# EAGLE design RobotControlBoard (EAGLE 6.5.0)
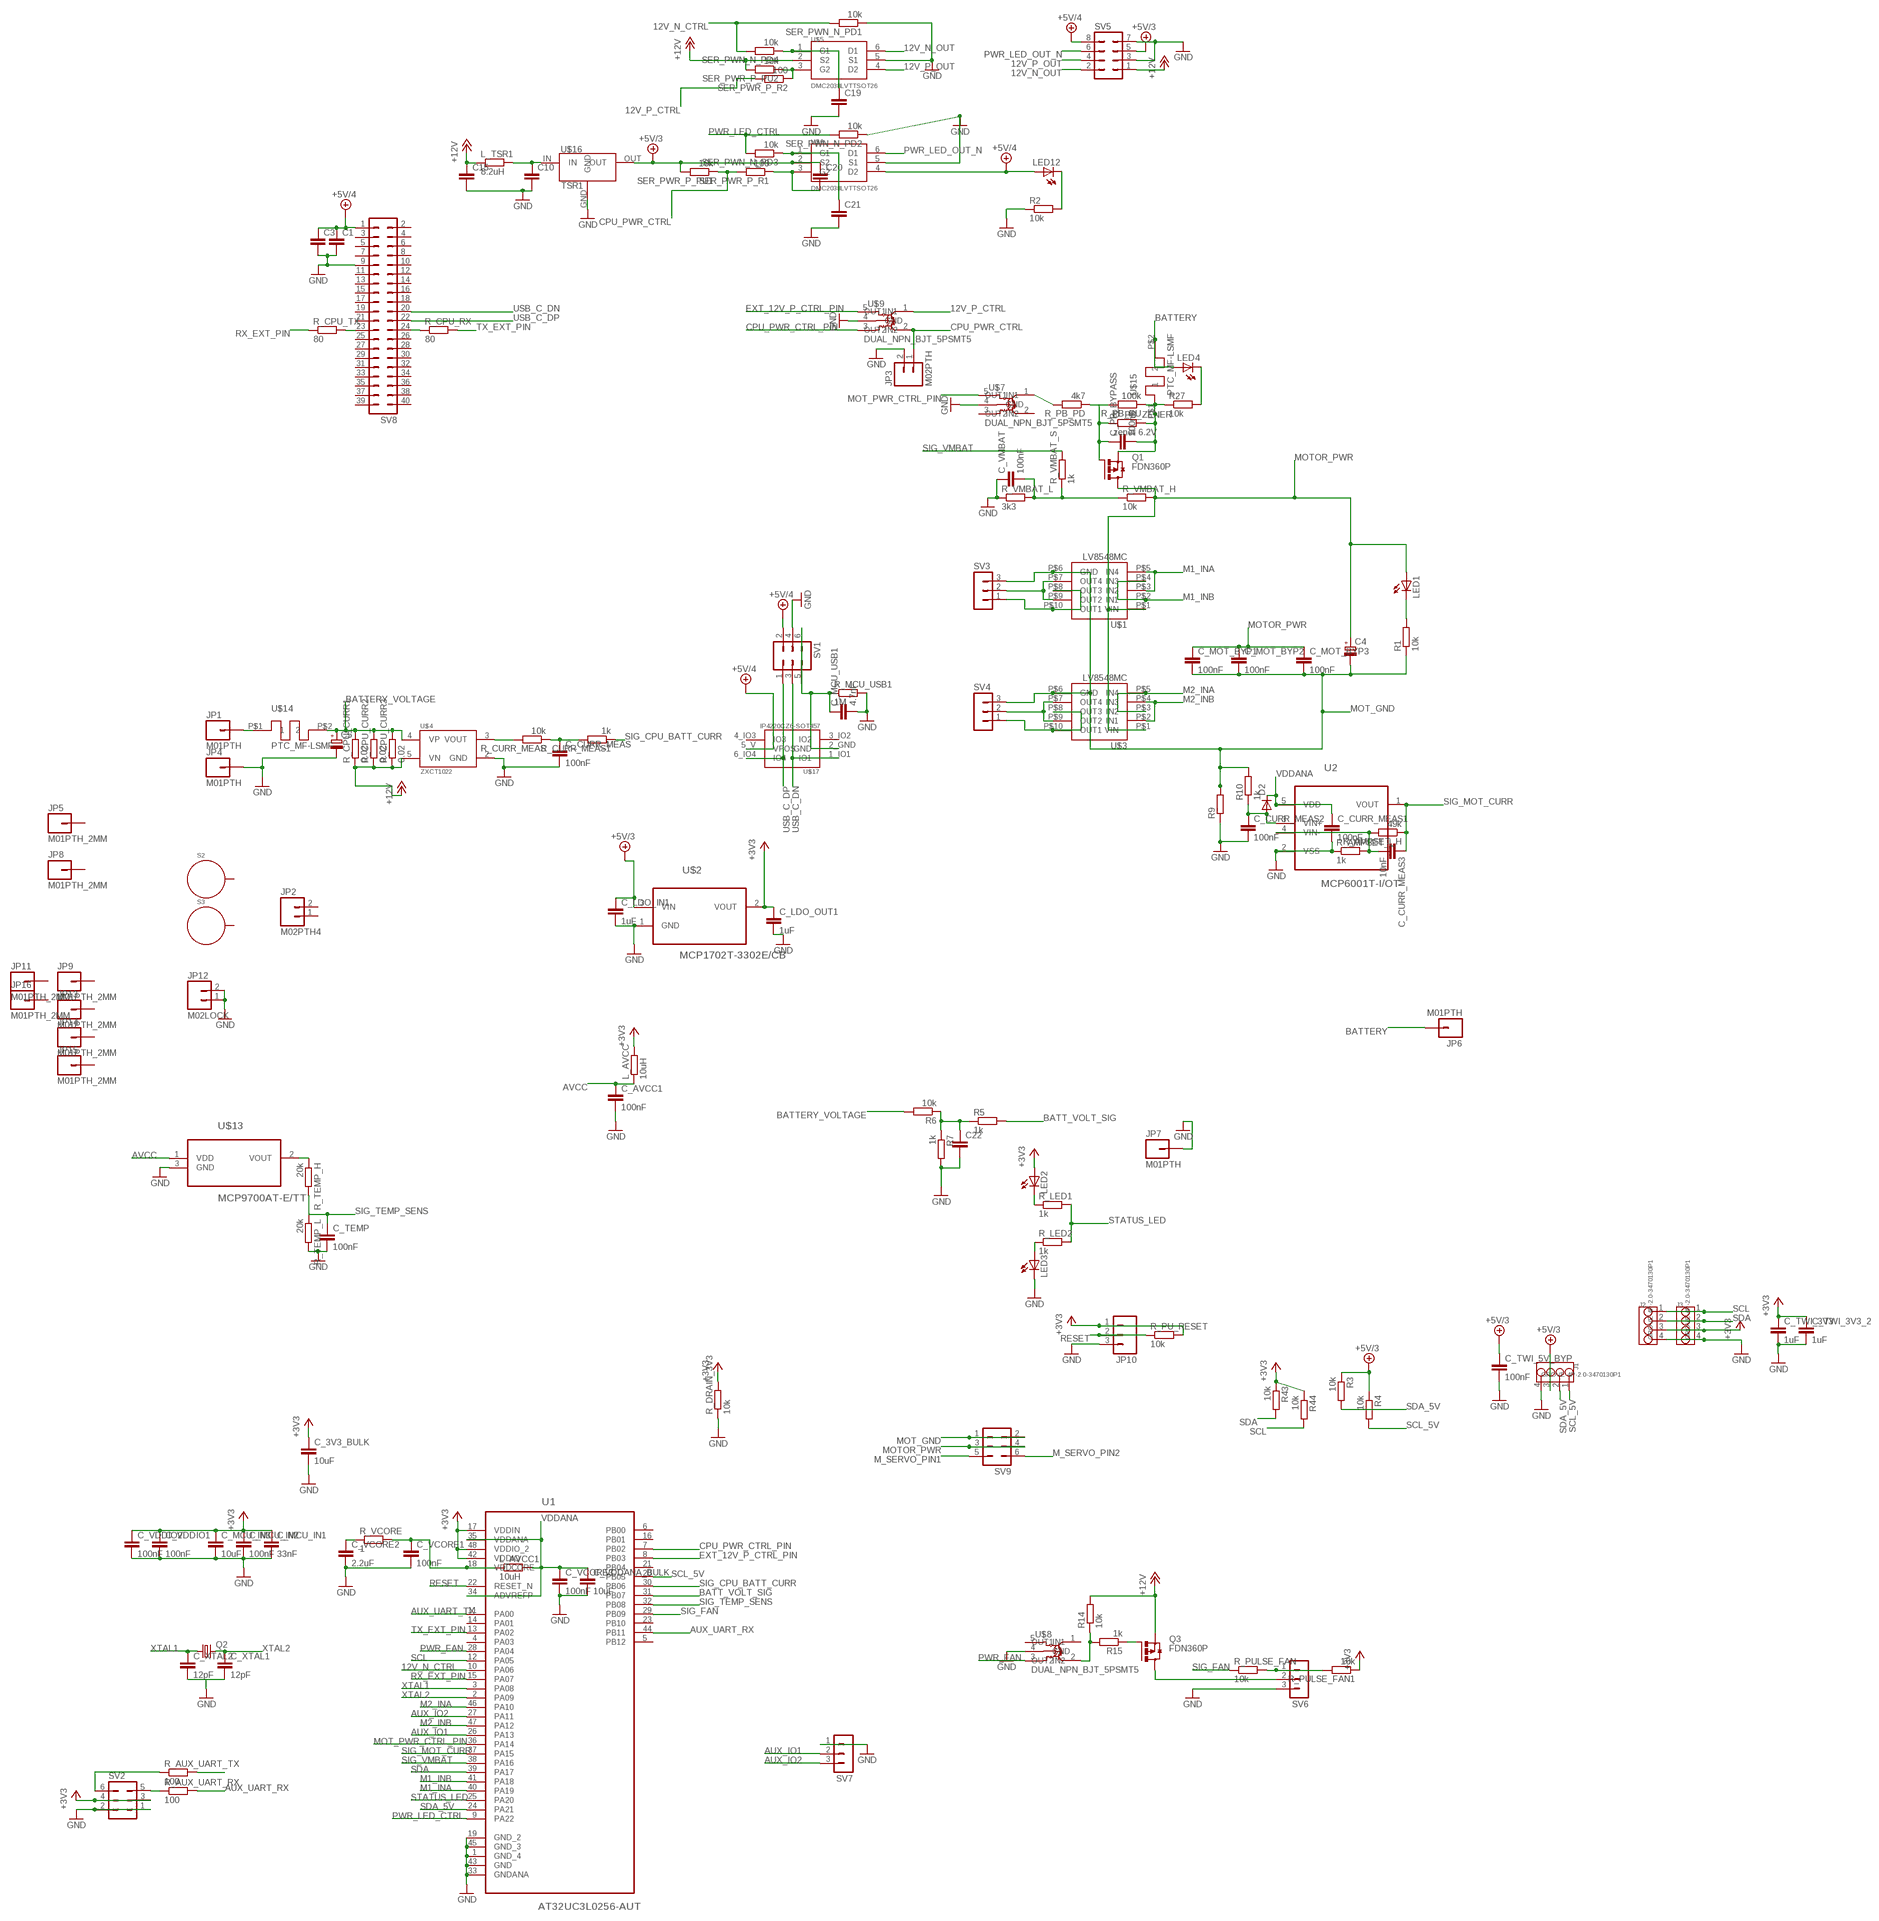
[diagram p0: schematic, sheet 1]

## Parts
C1  C-EUC1210K  [C1210K]
C3  C-EUC1210K  [C1210K]
C4  CPOL-EUE3.5-8  [E3,5-8]
C5  CPOL-EUE2.5-6  [E2,5-6]
C10  C-EUC0805  [C0805]
C15  C-EUC0805  [C0805]
C19  C-EUC0603K  [C0603K]
C20  C-EUC0603K  [C0603K]
C21  C-EUC0603K  [C0603K]
C22  C-EUC0603K  [C0603K]
C_3V3_BULK  10uF  C-EUC1206  [C1206]
C_AVCC1  100nF  C-EUC0603  [C0603]
C_CURR_MEAS  100nF  C-EUC0603K  [C0603K]
C_CURR_MEAS1  100nF  C-EUC0603K  [C0603K]
C_CURR_MEAS2  100nF  C-EUC0603K  [C0603K]
C_CURR_MEAS3  10nF  C-EUC0603K  [C0603K]
C_LDO_IN1  1uF  C-EUC0805  [C0805]
C_LDO_OUT1  1uF  C-EUC0805  [C0805]
C_MCU_IN1  33nF  C-EUC0603K  [C0603K]
C_MCU_IN2  100nF  C-EUC0603K  [C0603K]
C_MCU_IN3  10uF  C-EUC0805  [C0805]
C_MCU_USB1  4.7nF  C-EUC0603  [C0603]
C_MOT_BYP1  100nF  C-EUC0603K  [C0603K]
C_MOT_BYP2  100nF  C-EUC0603K  [C0603K]
C_MOT_BYP3  100nF  C-EUC0603K  [C0603K]
C_PB_BYPASS  100nF  C-EUC0603K  [C0603K]
C_TEMP  100nF  C-EUC0603  [C0603]
C_TWI_3V3  1uF  C-EUC0805K  [C0805K]
C_TWI_3V3_2  1uF  C-EUC0805K  [C0805K]
C_TWI_5V_BYP  100nF  C-EUC0603K  [C0603K]
C_VCORE1  100nF  C-EUC0603K  [C0603K]
C_VCORE2  2.2uF  C-EUC0805  [C0805]
C_VCORE3  100nF  C-EUC0603K  [C0603K]
C_VDDANA_BULK  10uF  C-EUC0805  [C0805]
C_VDDIO1  100nF  C-EUC0603K  [C0603K]
C_VDDIO2  100nF  C-EUC0603K  [C0603K]
C_VMBAT  100nF  C-EUC0603K  [C0603K]
C_XTAL1  12pF  C-EUC0603K  [C0603K]
C_XTAL2  12pF  C-EUC0603K  [C0603K]
D2  DIODE-SOD323-W  [SOD323-W]
D_PB_ZENER  zener 6.2V  R-EU_R0805W  [R0805W]
J1  GROVE-4P-2.0-3470130P1  [4P-2.0]
J2  GROVE-4P-2.0-3470130P1  [4P-2.0]
J3  GROVE-4P-2.0-3470130P1  [4P-2.0]
JP1  M01PTH  [1X01]
JP2  M02PTH4  [1X02_XTRA_BIG]
JP3  M02PTH  [1X02]
JP4  M01PTH  [1X01]
JP5  M01PTH_2MM  [1X01_2MM]
JP6  M01PTH  [1X01]
JP7  M01PTH  [1X01]
JP8  M01PTH_2MM  [1X01_2MM]
JP9  M01PTH_2MM  [1X01_2MM]
JP10  M03PTH  [1X03]
JP11  M01PTH_2MM  [1X01_2MM]
JP12  M02LOCK  [1X02_LOCK]
JP13  M01PTH_2MM  [1X01_2MM]
JP14  M01PTH_2MM  [1X01_2MM]
JP15  M01PTH_2MM  [1X01_2MM]
JP16  M01PTH_2MM  [1X01_2MM]
L_AVCC  10uH  R-EU_R0603  [R0603]
L_AVCC1  10uH  R-EU_R0805  [R0805]
L_TSR1  8.2uH  R-EU_M0805  [M0805]
LED1  LEDSML0603  [SML0603]
LED2  LEDSML0603  [SML0603]
LED3  LEDSML0603  [SML0603]
LED4  LEDSML0603  [SML0603]
LED12  LEDSML0603  [SML0603]
Q1  FDN360P  [SUPER-SOT3]
Q2  CRYSTALHC49S  [HC49/S]
Q3  FDN360P  [SUPER-SOT3]
R1  10k  R-EU_R0603  [R0603]
R2  10k  R-EU_R0603  [R0603]
R3  10k  R-EU_R0603  [R0603]
R4  10k  R-EU_R0603  [R0603]
R5  1k  R-EU_R0603  [R0603]
R6  10k  R-EU_R0603  [R0603]
R7  1k  R-EU_R0603  [R0603]
R9  R-EU_M1206  [M1206]
R10  1k  R-EU_R0603  [R0603]
R14  10k  R-EU_R0603  [R0603]
R15  1k  R-EU_R0603  [R0603]
R27  10k  R-EU_R0603  [R0603]
R43  10k  R-EU_R0603  [R0603]
R44  10k  R-EU_R0603  [R0603]
R_AMPSET_H  49k  R-EU_R0603  [R0603]
R_AMPSET_L  1k  R-EU_R0603  [R0603]
R_AUX_UART_RX  100  R-EU_R0603  [R0603]
R_AUX_UART_TX  100  R-EU_R0603  [R0603]
R_CPU_CURR1  0.02  R-EU_R0805  [R0805]
R_CPU_CURR2  0.02  R-EU_R0805  [R0805]
R_CPU_CURR3  0.02  R-EU_R0805  [R0805]
R_CPU_RX  80  R-EU_R0603  [R0603]
R_CPU_TX  80  R-EU_R0603  [R0603]
R_CURR_MEAS  10k  R-EU_R0603  [R0603]
R_CURR_MEAS1  1k  R-EU_R0603  [R0603]
R_DRAIN_3V3  10k  R-EU_R0603  [R0603]
R_LED1  1k  R-EU_R0603  [R0603]
R_LED2  1k  R-EU_R0603  [R0603]
R_MCU_USB1  1M  R-EU_R0603  [R0603]
R_PB_PD  4k7  R-EU_R0603  [R0603]
R_PB_PU  100k  R-EU_R0603  [R0603]
R_PU_RESET  10k  R-EU_R0603  [R0603]
R_PULSE_FAN  10k  R-EU_R0603  [R0603]
R_PULSE_FAN1  10k  R-EU_R0603  [R0603]
R_TEMP_H  20k  R-EU_R0603  [R0603]
R_TEMP_L  20k  R-EU_R0603  [R0603]
R_VCORE  1  R-EU_R0603  [R0603]
R_VMBAT_H  10k  R-EU_R0603  [R0603]
R_VMBAT_L  3k3  R-EU_R0603  [R0603]
R_VMBAT_S  1k  R-EU_R0603  [R0603]
S2  STANDOFF_ELECTRICAL  [STANDOFF-ELECTRICAL]
S3  STANDOFF_ELECTRICAL  [STANDOFF-ELECTRICAL]
SER_PWN_N_PD1  10k  R-EU_R0603  [R0603]
SER_PWN_N_PD2  10k  R-EU_R0603  [R0603]
SER_PWN_N_PD3  10k  R-EU_R0603  [R0603]
SER_PWN_N_PD4  10k  R-EU_R0603  [R0603]
SER_PWR_P_PU1  10k  R-EU_R0603  [R0603]
SER_PWR_P_PU2  10k  R-EU_R0603  [R0603]
SER_PWR_P_R1  100  R-EU_R0603  [R0603]
SER_PWR_P_R2  100  R-EU_R0603  [R0603]
SV1  MA03-2  [MA03-2]
SV2  MA03-2  [MA03-2]
SV3  MA03-1  [MA03-1]
SV4  MA03-1  [MA03-1]
SV5  MA04-2  [MA04-2]
SV6  MA03-1  [MA03-1]
SV7  MA03-1  [MA03-1]
SV8  MA20-2  [MA20-2]
SV9  MA03-2  [MA03-2]
U1  AT32UC3L0256-AUT  [QFP50P900X900X120-48N]
U2  MCP6001T-I/OT  [SOT95P270X145-5N]
U$1  LV8548MC  [SOIC10]
U$2  MCP1702T-3302E/CB  [SOT95P255X145-3N]
U$3  LV8548MC  [SOIC10]
U$4  ZXCT1022  [SOT23-5]
U$5  DMC2038LVTTSOT26  [TSOT26]
U$6  DMC2038LVTTSOT26  [TSOT26]
U$7  DUAL_NPN_BJT_5PSMT5  [SC-74A]
U$8  DUAL_NPN_BJT_5PSMT5  [SC-74A]
U$9  DUAL_NPN_BJT_5PSMT5  [SC-74A]
U$13  MCP9700AT-E/TT  [SOT95P237X112-3N]
U$14  PTC_MF-LSMF  [PTC_FUSE_BOURNS]
U$15  PTC_MF-LSMF  [PTC_FUSE_BOURNS]
U$16  TSR1  [TSR-1]
U$17  IP4220CZ6-SOT457  [SOT457_NXP_ESD]

## Nets
12V_N_CTRL: SER_PWN_N_PD1.2 SER_PWN_N_PD4.2 U1.10(PA06)
12V_N_OUT: SV5.2 U$5.6(D1)
12V_P_CTRL: SER_PWR_P_R2.2 U$9.1(OUT1)
12V_P_OUT: SV5.4 U$5.4(D2)
+3V3: C_3V3_BULK.1 C_LDO_OUT1.1 C_MCU_IN1.1 C_MCU_IN2.1 C_MCU_IN3.1 C_TWI_3V3.1 C_TWI_3V3_2.1 C_VDDIO1.1 C_VDDIO2.1 J2.3 J3.3 JP10.1 L_AVCC.2 LED2.A R43.1 R44.1 R_DRAIN_3V3.2 R_PU_RESET.2 R_PULSE_FAN1.1 SV2.3 SV2.4 U1.17(VDDIN) U1.42(VDDIO) U1.48(VDDIO_2) U$2.2(VOUT)
+5V/3: C20.1 C_LDO_IN1.1 C_TWI_5V_BYP.1 J1.3 R3.1 R4.1 SER_PWR_P_PU1.2 SV5.5 U$2.3(VIN) U$6.2(S2) U$16.OUT
+5V/4: C1.1 C3.1 LED12.A SV1.2 SV5.8 SV8.1 U$6.4(D2) U$17.5_V(VPOS)
+12V: C15.1 L_TSR1.1 Q3.2(S) R14.2 R_CPU_CURR1.1 R_CPU_CURR2.1 R_CPU_CURR3.1 SER_PWR_P_PU2.2 SV5.1 U$4.5(VN) U$5.2(S2)
AUX_IO1: SV7.2 U1.26(PA13)
AUX_IO2: SV7.3 U1.27(PA11)
AUX_UART_RX: R_AUX_UART_RX.2 U1.44(PB11)
AUX_UART_TX: R_AUX_UART_TX.2 U1.11(PA00)
AVCC: C_AVCC1.1 L_AVCC.1 U$13.1(VDD)
BATT_VOLT_SIG: R5.2 U1.31(PB07)
BATT_VOLT_SIG_N: C22.1 R5.1 R6.1 R7.1
BATTERY: JP6.1 LED4.A U$15.P$2
BATTERY_VOLTAGE: C5.+ R6.2 R_CPU_CURR1.2 R_CPU_CURR2.2 R_CPU_CURR3.2 U$4.4(VP) U$14.P$2
CPU_PWR_CTRL: JP3.1 SER_PWR_P_PU1.1 SER_PWR_P_R1.2 U$9.2(OUT2)
CPU_PWR_CTRL_PIN: U1.7(PB02) U$9.3(IN2)
EXT_12V_P_CTRL_PIN: U1.8(PB03) U$9.5(IN1)
GND: C1.2 C3.2 C5.- C10.2 C15.2 C19.2 C21.2 C22.2 C_3V3_BULK.2 C_AVCC1.2 C_CURR_MEAS1.2 C_CURR_MEAS2.2 C_CURR_MEAS.2 C_LDO_IN1.2 C_LDO_OUT1.2 C_MCU_IN1.2 C_MCU_IN2.2 C_MCU_IN3.2 C_MCU_USB1.2 C_TEMP.2 C_TWI_3V3.2 C_TWI_3V3_2.2 C_TWI_5V_BYP.2 C_VCORE1.2 C_VCORE2.2 C_VCORE3.2 C_VDDANA_BULK.2 C_VDDIO1.2 C_VDDIO2.2 C_VMBAT.1 C_XTAL1.2 C_XTAL2.2 J1.4 J2.4 J3.4 JP3.2 JP4.1 JP7.1 JP10.3 JP12.1 JP12.2 LED3.C R2.1 R7.2 R9.1 R_AMPSET_L.1 R_DRAIN_3V3.1 R_MCU_USB1.2 R_TEMP_L.2 R_VMBAT_L.1 SER_PWN_N_PD1.1 SER_PWN_N_PD2.1 SV1.4 SV2.1 SV2.2 SV5.3 SV5.7 SV6.3 SV7.1 SV8.9 U1.1(GND_4) U1.19(GND_2) U1.33(GNDANA) U1.43(GND) U1.45(GND_3) U2.2(VSS) U$2.1(GND) U$4.2(GND) U$5.5(S1) U$6.5(S1) U$7.4(GND) U$8.4(GND) U$9.4(GND) U$13.3(GND) U$16.GND
M1_INA: U1.40(PA19) U$1.P$3(IN2) U$1.P$5(IN4)
M1_INB: U1.41(PA18) U$1.P$2(IN1) U$1.P$4(IN3)
M2_INA: U1.46(PA10) U$3.P$3(IN2) U$3.P$5(IN4)
M2_INB: U1.47(PA12) U$3.P$2(IN1) U$3.P$4(IN3)
M_SERVO_PIN1: SV9.5
M_SERVO_PIN2: SV9.6
MOT_GND: C4.- C_MOT_BYP1.2 C_MOT_BYP2.2 C_MOT_BYP3.2 R1.1 R9.2 R10.2 SV3.3 SV4.3 SV9.1 SV9.2 U$1.P$6(GND) U$3.P$6(GND)
MOT_PWR_CTRL_PIN: U1.36(PA14) U$7.5(IN1)
MOTOR_PWR: C4.+ C_MOT_BYP1.1 C_MOT_BYP2.1 C_MOT_BYP3.1 LED1.A Q1.3(D) R_VMBAT_H.2 SV9.3 SV9.4 U$1.P$1(VIN) U$3.P$1(VIN)
N$1: R_AUX_UART_RX.1 SV2.5
N$2: LED3.A R_LED2.1
N$3: LED2.C R_LED1.1
N$4: R_CURR_MEAS.2 U$4.3(VOUT)
N$5: C_VMBAT.2 R_VMBAT_H.1 R_VMBAT_L.2 R_VMBAT_S.1
N$6: JP1.1 U$14.P$1
N$7: C_VCORE2.1 R_VCORE.1
N$10: C20.2 SER_PWR_P_R1.1 U$6.3(G2)
N$11: SV3.1 U$1.P$8(OUT3) U$1.P$10(OUT1)
N$12: C19.1 SER_PWN_N_PD4.1 U$5.1(G1)
N$13: SV3.2 U$1.P$7(OUT4) U$1.P$9(OUT2)
N$14: C_PB_BYPASS.2 D_PB_ZENER.2 Q1.2(S) R27.1 R_PB_PU.1 U$15.P$1
N$15: SER_PWR_P_PU2.1 SER_PWR_P_R2.1 U$5.3(G2)
N$16: R_AUX_UART_TX.1 SV2.6
N$17: C_PB_BYPASS.1 D_PB_ZENER.1 Q1.1(G) R_PB_PD.1 R_PB_PU.2
N$18: R_TEMP_H.1 U$13.2(VOUT)
N$19: R_PB_PD.2 U$7.1(OUT1)
N$20: LED1.C R1.2
N$21: SV4.2 U$3.P$7(OUT4) U$3.P$9(OUT2)
N$22: SV4.1 U$3.P$8(OUT3) U$3.P$10(OUT1)
N$24: C_VCORE1.1 L_AVCC1.1 R_VCORE.2 U1.18(VDDCORE)
N$25: C10.1 L_TSR1.2 U$16.IN
N$26: C_CURR_MEAS2.1 D2.A R10.1 U2.3(VIN+)
N$27: C_CURR_MEAS3.2 R_AMPSET_H.2 R_AMPSET_L.2 U2.4(VIN-)
N$28: LED4.C R27.2
N$30: R_CPU_RX.1 SV8.24
N$31: R_CPU_TX.2 SV8.23
N$32: C_MCU_USB1.1 R_MCU_USB1.1 SV1.5 SV1.6 U$17.2_GND(GND)
N$34: Q3.1(G) R15.1
N$35: R14.1 R15.2 U$8.2(OUT2)
N$37: Q3.3(D) SV6.2
N$38: R_PULSE_FAN1.2 R_PULSE_FAN.2 SV6.1
N$42: C21.1 SER_PWN_N_PD3.1 U$6.1(G1)
N$45: LED12.C R2.2
PWR_FAN: U1.28(PA04) U$8.3(IN2)
PWR_LED_CTRL: SER_PWN_N_PD2.2 SER_PWN_N_PD3.2 U1.9(PA22)
PWR_LED_OUT_N: SV5.6 U$6.6(D1)
RESET: JP10.2 R_PU_RESET.1 U1.22(RESET_N)
RX_EXT_PIN: R_CPU_TX.1 U1.15(PA07)
SCL: J2.1 J3.1 R44.2 U1.12(PA05)
SCL_5V: J1.1 R4.2 U1.20(PB05)
SDA: J2.2 J3.2 R43.2 U1.39(PA17)
SDA_5V: J1.2 R3.2 U1.24(PA21)
SIG_CPU_BATT_CURR: R_CURR_MEAS1.1 U1.30(PB06)
SIG_CPU_BATT_CURRENT_N: C_CURR_MEAS.1 R_CURR_MEAS1.2 R_CURR_MEAS.1
SIG_FAN: R_PULSE_FAN.1 U1.29(PB09)
SIG_MOT_CURR: C_CURR_MEAS3.1 R_AMPSET_H.1 U1.37(PA15) U2.1(VOUT)
SIG_TEMP_SENS: C_TEMP.1 R_TEMP_H.2 R_TEMP_L.1 U1.32(PB08)
SIG_VMBAT: R_VMBAT_S.2 U1.38(PA16)
STATUS_LED: R_LED1.2 R_LED2.2 U1.25(PA20)
TX_EXT_PIN: R_CPU_RX.2 U1.13(PA02)
USB_C_DN: SV1.3 SV8.20 U$17.1_IO1(IO1)
USB_C_DP: SV1.1 SV8.22 U$17.6_IO4(IO4)
VDDANA: C_CURR_MEAS1.1 C_VCORE3.1 C_VDDANA_BULK.1 D2.C L_AVCC1.2 U1.34(ADVREFP) U1.35(VDDANA) U2.5(VDD)
XTAL1: C_XTAL2.1 Q2.1 U1.3(PA08)
XTAL2: C_XTAL1.1 Q2.2 U1.2(PA09)
Unconnected: JP2.1 JP2.2 JP5.1 JP8.1 JP9.1 JP11.1 JP13.1 JP14.1 JP15.1 JP16.1 S2.P1 S3.P1 SV8.2 SV8.3 SV8.4 SV8.5 SV8.6 SV8.7 SV8.8 SV8.10 SV8.11 SV8.12 SV8.13 SV8.14 SV8.15 SV8.16 SV8.17 SV8.18 SV8.19 SV8.21 SV8.25 SV8.26 SV8.27 SV8.28 SV8.29 SV8.30 SV8.31 SV8.32 SV8.33 SV8.34 SV8.35 SV8.36 SV8.37 SV8.38 SV8.39 SV8.40 U1.4(PA03) U1.5(PB12) U1.6(PB00) U1.14(PA01) U1.16(PB01) U1.21(PB04) U1.23(PB10) U$7.2(OUT2) U$7.3(IN2) U$8.1(OUT1) U$8.5(IN1) U$17.3_IO2(IO2) U$17.4_IO3(IO3)

## Library data of the parts
C1 C3 C10 C15 C19-C22 C_3V3_BULK C_AVCC1 C_CURR_MEAS C_CURR_MEAS1-C_CURR_MEAS3 C_LDO_IN1 C_LDO_OUT1 C_MCU_IN1-C_MCU_IN3 C_MCU_USB1 C_MOT_BYP1-C_MOT_BYP3 C_PB_BYPASS C_TEMP C_TWI_3V3 C_TWI_3V3_2 C_TWI_5V_BYP C_VCORE1-C_VCORE3 C_VDDANA_BULK C_VDDIO1 C_VDDIO2 C_VMBAT C_XTAL1 C_XTAL2 = resistor:C-EU: CAPACITOR, European symbol
C4 C5 = resistor:CPOL-EU: POLARIZED CAPACITOR, European symbol
D2 = diode:DIODE-: DIODE
D_PB_ZENER L_AVCC L_AVCC1 L_TSR1 R1-R7 R9 R10 R14 R15 R27 R43 R44 R_AMPSET_H R_AMPSET_L R_AUX_UART_RX R_AUX_UART_TX R_CPU_CURR1-R_CPU_CURR3 R_CPU_RX R_CPU_TX R_CURR_MEAS R_CURR_MEAS1 R_DRAIN_3V3 R_LED1 R_LED2 R_MCU_USB1 R_PB_PD R_PB_PU R_PU_RESET R_PULSE_FAN R_PULSE_FAN1 R_TEMP_H R_TEMP_L R_VCORE R_VMBAT_H R_VMBAT_L R_VMBAT_S SER_PWN_N_PD1-SER_PWN_N_PD4 SER_PWR_P_PU1 SER_PWR_P_PU2 SER_PWR_P_R1 SER_PWR_P_R2 = resistor:R-EU_: RESISTOR, European symbol
J1-J3 = OPLEagle:GROVE-4P-2.0
JP1 JP4-JP9 JP11 JP13-JP16 = SparkFun-Connectors:M01: Header 1 Standard 1-pin 0.1" header. Use with straight break away headers (SKU : PRT-00116), right angle break away headers (PRT-00553), swiss pins (PRT-00743), machine pins (PRT-00117), and female headers (PRT-00115).
JP2 JP3 JP12 = SparkFun-Connectors:M02: Standard 2-pin 0.1" header. Use with - straight break away headers ( PRT-00116) - right angle break away headers (PRT-00553) - swiss pins (PRT-00743) - machine pins (PRT-00117) - female headers (PRT-00115) Molex polarized connector foot print use with: PRT-08233 with associated crimp pins and housings. 2.54_SCREWTERM for use with PRT-10571. 3.5mm Screw Terminal footprints for PRT-08084 5mm Screw Terminal footprints for use with PRT-08433
JP10 = SparkFun-Connectors:M03: Header 3 Standard 3-pin 0.1" header. Use with straight break away headers (SKU : PRT-00116), right angle break away headers (PRT-00553), swiss pins (PRT-00743), machine pins (PRT-00117), and female headers (PRT-00115). Molex polarized connector foot print use with SKU : PRT-08232 with associated crimp pins and housings.
LED1-LED4 LED12 = led:LED: LED OSRAM: - CHIPLED LG R971, LG N971, LY N971, LG Q971, LY Q971, LO R971, LY R971 LH N974, LH R974 LS Q976, LO Q976, LY Q976 LO Q996 - Hyper CHIPLED LW Q18S LB Q993, LB Q99A, LB R99A - SideLED LS A670, LO A670, LY A670, LG A670, LP A670 LB A673, LV A673, LT A673, LW A673 LH A674 LY A675 LS A676, LA A676, LO A676, LY A676, LW A676 LS A679, LY A679, LG A679 - Hyper Micro SIDELED® LS Y876, LA Y876, LO Y876, LY Y876 LT Y87S - SmartLED LW L88C, LW L88S LB L89C, LB L89S, LG L890 LS L89K, LO L89K, LY L89K LS L896, LA L896, LO L896, LY L896 - TOPLED LS T670, LO T670, LY T670, LG T670, LP T670 LSG T670, LSP T670, LSY T670, LOP T670, LYG T670 LG T671, LOG T671, LSG T671 LB T673, LV T673, LT T673, LW T673 LH T674 LS T676, LA T676, LO T676, LY T676, LB T676, LH T676, LSB T676, LW T676 LB T67C, LV T67C, LT T67C, LS T67K, LO T67K, LY T67K, LW E67C LS E67B, LA E67B, LO E67B, LY E67B, LB E67C, LV E67C, LT E67C LW T67C LS T679, LY T679, LG T679 LS T770, LO T770, LY T770, LG T770, LP T770 LB T773, LV T773, LT T773, LW T773 LH T774 LS E675, LA E675, LY E675, LS T675 LS T776, LA T776, LO T776, LY T776, LB T776 LHGB T686 LT T68C, LB T68C - Hyper Mini TOPLED® LB M676 - Mini TOPLED Santana® LG M470 LS M47K, LO M47K, LY M47K Source: http://www.osram.convergy.de LUXEON: - LUMILED® LXK2-PW12-R00, LXK2-PW12-S00, LXK2-PW14-U00, LXK2-PW14-V00 LXK2-PM12-R00, LXK2-PM12-S00, LXK2-PM14-U00 LXK2-PE12-Q00, LXK2-PE12-R00, LXK2-PE12-S00, LXK2-PE14-T00, LXK2-PE14-U00 LXK2-PB12-K00, LXK2-PB12-L00, LXK2-PB12-M00, LXK2-PB14-N00, LXK2-PB14-P00, LXK2-PB14-Q00 LXK2-PR12-L00, LXK2-PR12-M00, LXK2-PR14-Q00, LXK2-PR14-R00 LXK2-PD12-Q00, LXK2-PD12-R00, LXK2-PD12-S00 LXK2-PH12-R00, LXK2-PH12-S00 LXK2-PL12-P00, LXK2-PL12-Q00, LXK2-PL12-R00 Source: www.luxeon.com KINGBRIGHT: KA-3528ASYC Source: www.kingbright.com
Q1 Q3 = transistor-power:FDN360P: Single P-Channel, PowerTrench (R) MOSFET Source: http://www.fairchildsemi.com/ds/FD/FDN360P.pdf
Q2 = crystal:CRYSTAL: CRYSTAL; OC_FARNELL: 1667008; OC_NEWARK: unknown
S2 S3 = SparkFun-Electromechanical:STANDOFF_ELECTRICAL: A standoff intended to be an electrically connected point. Pad size and stop size allow for a #4 Phillips pan screw head to make a solid connection to the board.
SV1 SV2 SV9 = con-lstb:MA03-2: PIN HEADER; OC_FARNELL: unknown; OC_NEWARK: unknown
SV3 SV4 SV6 SV7 = con-lstb:MA03-1: PIN HEADER; OC_FARNELL: unknown; OC_NEWARK: unknown
SV5 = con-lstb:MA04-2: PIN HEADER; OC_FARNELL: unknown; OC_NEWARK: unknown
SV8 = con-lstb:MA20-2: PIN HEADER; OC_FARNELL: unknown; OC_NEWARK: unknown
U1 = jmsSwitches:AT32UC3L0256-AUT: MCU, 32BIT, 128K FLASH, TQFP-48; MPN: AT32UC3L0256-AUT; OC_FARNELL: 1972037; OC_NEWARK: 68T4614; PACKAGE: TQFP-48; SUPPLIER: ATMEL
U2 = jmsSwitches:MCP6001T-I/OT: IC, 1 MHz, Low-Power Op Amp,SOT-23-5; MPN: MCP6001T-I/OT; OC_FARNELL: 4974992; OC_NEWARK: 72C4269; PACKAGE: SOT23-5; SUPPLIER: Microchip
U$1 U$3 = jmsSwitches:LV8548MC: 1A Motor Driver
U$2 = jmsSwitches:MCP1702T-3302E/CB: 250 mA Low Quiescent Current LDO Regulator; MPN: MCP1702T-3302E/CB; OC_FARNELL: 1331490; OC_NEWARK: 84R5179; PACKAGE: SOT23-3; SUPPLIER: Microchip
U$4 = jmsSwitches:ZXCT1022: High-side current sensor. Needs a resistor, e.g. 0.05Ohm. Out = 100 x VP - VN
U$5 U$6 = jmsSwitches:DMC2038LVT
U$7-U$9 = jmsSwitches:DUAL_NPN_BJT_5P
U$13 = jmsSwitches:MCP9700AT-E/TT: Low-Power Linear Active Thermistor; MPN: MCP9700AT-E/TT; OC_FARNELL: 1605577; OC_NEWARK: 84R5199; PACKAGE: SOT-3; SUPPLIER: MICROCHIP
U$14 U$15 = jmsSwitches:PTC_MF-LSMF: Resettable fuse, PTC. Bourns MF-LSMF series. Up to 33V and 40A. Farnell: 2057923
U$16 = jmsSwitches:TSR1: Switching regulator, integrated. No need for external components unless Vin is more than 32V. Then use a 22uF 50V capacitor. Max output capacitive load 470uF. Max ambient temperature 60degC. Max Iout 1A. Min Vin 6.5V for 5V out variant. See datasheet for the others.
U$17 = jmsSwitches:IP4220CZ6: ESD protecto for 4 IO lines. Good for USB.

## Board
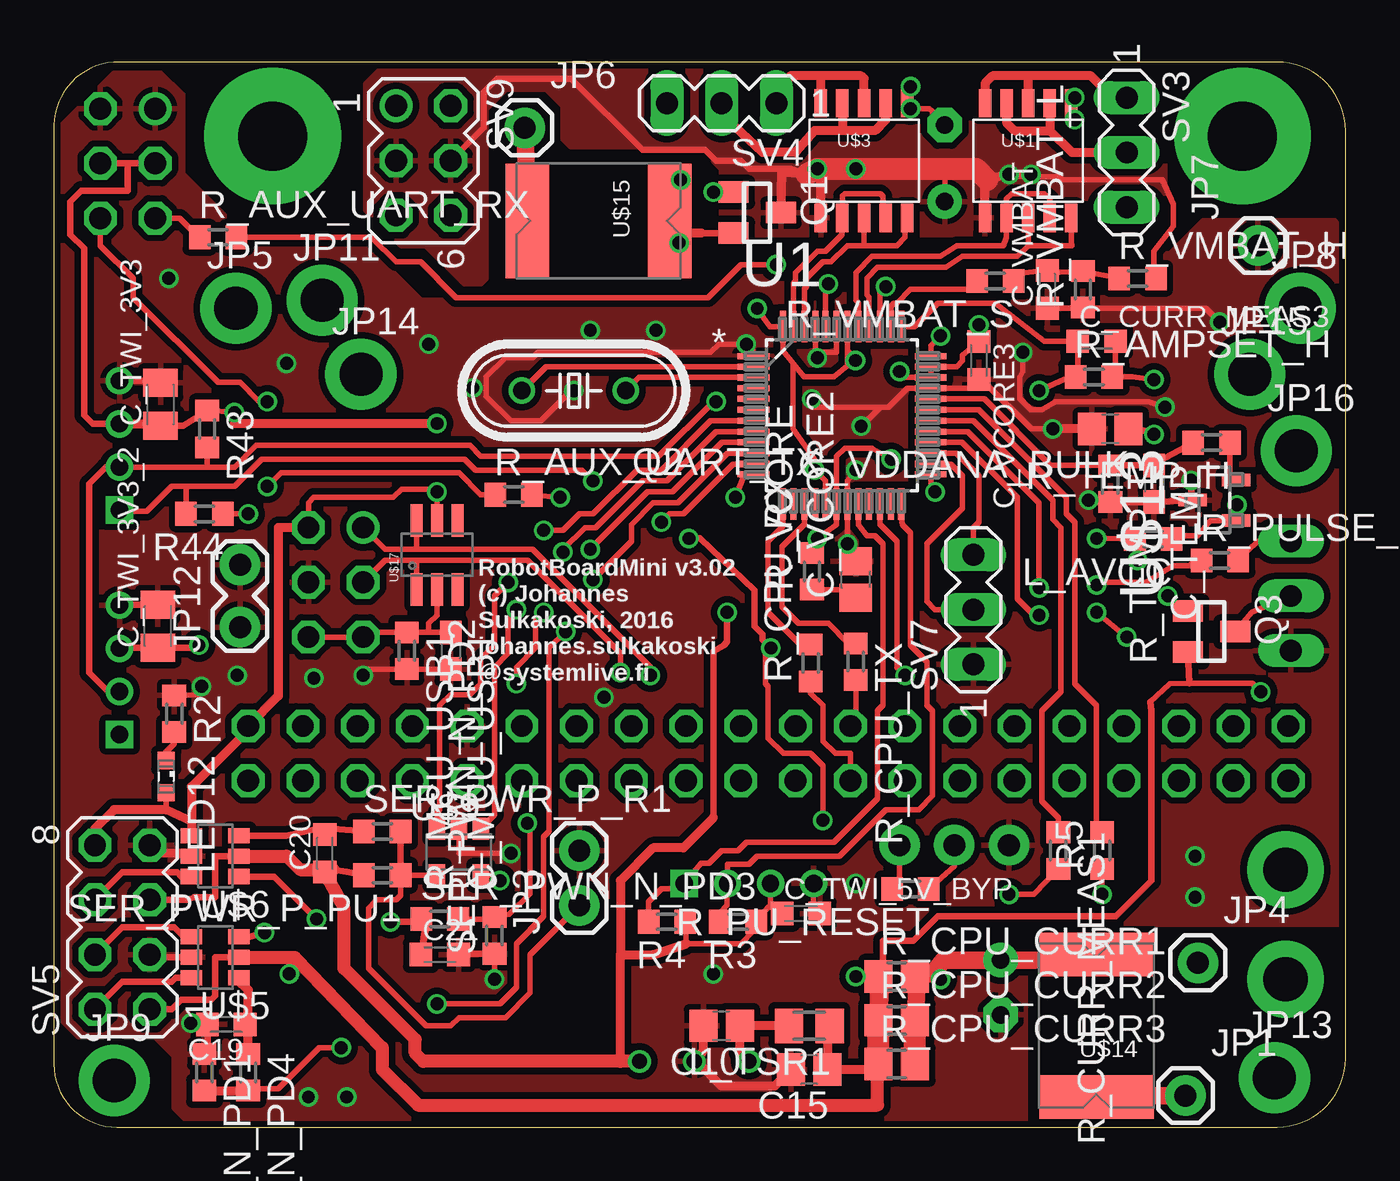
[diagram p1: board, top side]
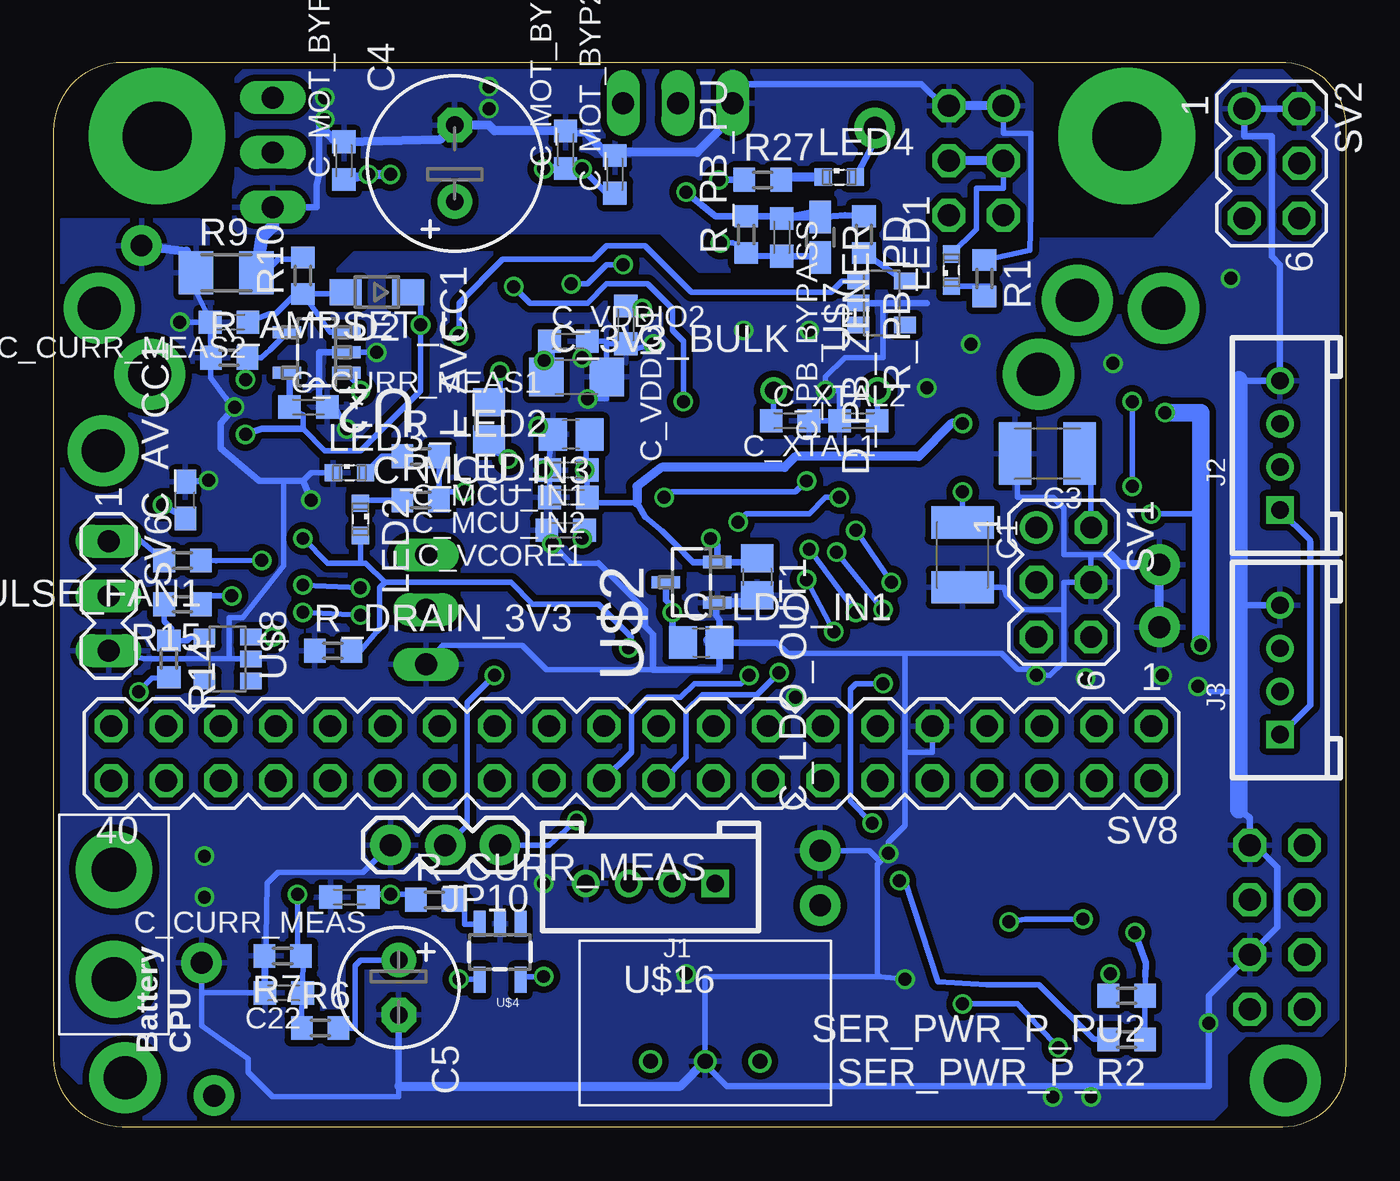
[diagram p2: board, bottom side, seen from below]

Size 59.94 x 49.4 mm. Coordinates in mm from the lower left corner, seen from the top.
Outline: 0,46.48 0,2.92 arc90 2.92,0 56.77,0 arc90 59.94,3.17 59.94,46.23 arc90 56.77,49.4 3.05,49.4 arc90 0,46.48
Copper layers (1*2*15*16): Top 0.035mm / dielectric 0.2mm / layer 2 0.0175mm / dielectric 1.1mm / layer 15 0.0175mm / dielectric 0.2mm / Bottom 0.035mm
Design rules "SeeedStudio_DRU_no_angle_20130527": minimum track width 6mil, minimum drill 12mil, track to track 6mil, track to pad 6mil, pad to pad 6mil, via to via 6mil, smd to smd 0mil, copper to edge 10mil, drill to drill 10mil, minimum pad ring 6mil, minimum via ring 6mil, stop-mask expansion 2mil, vias tented up to drill 25mil, thermal gap 10mil

### Footprints (pad centres in the part's own frame; a part is rotated, then mirrored left to right if it is on the bottom)
C1210K = smd 1.5 x 2.9: 1 -1.5,0; 2 1.5,0
E3,5-8 = drill 0.813 pad 1.6: + -1.778,0 | drill 0.813 pad 1.6 octagon: - 1.778,0
E2,5-6 = drill 0.813 pad 1.6: + -1.27,0 | drill 0.813 pad 1.6 octagon: - 1.27,0
C0805 = smd 1.3 x 1.5: 1 -0.85,0; 2 0.85,0
C0603K = smd 1.05 x 1.08: 1 -0.875,0; 2 0.875,0
C1206 = smd 1.6 x 1.8: 1 -1.4,0; 2 1.4,0
C0603 = smd 1.1 x 1: 1 -0.85,0; 2 0.85,0
C0805K = smd 1.3 x 1.6: 1 -1,0; 2 1,0
SOD323-W = smd 1.5 x 1.2: A 1.45,0; C -1.45,0
R0805W = smd 1.5 x 1: 1 -0.94,0; 2 0.94,0
4P-2.0 = drill 0.8 pad 1.27 square: 1 -3,0 | drill 0.8 pad 1.27: 2 -1,0; 3 1,0; 4 3,0
1X01 = drill 1.016 pad 1.88: 1 0,0
1X02_XTRA_BIG = drill 2.057 pad 3.556: 1 -2.54,0; 2 2.54,0
1X02 = drill 1.016 pad 1.88: 1 0,0; 2 2.54,0
1X01_2MM = drill 2 pad 3.302: 1 0,0
1X03 = drill 1.016 pad 1.88: 1 0,0; 2 2.54,0; 3 5.08,0
1X02_LOCK = drill 1.016 pad 1.88: 1 -0.178,0; 2 2.718,0
R0603 = smd 1 x 1.1: 1 -0.85,0; 2 0.85,0
R0805 = smd 1.3 x 1.5: 1 -0.85,0; 2 0.85,0
M0805 = smd 1.3 x 1.6: 1 -0.95,0; 2 0.95,0
SML0603 = smd 0.8 x 0.8: A 0.75,0; C -0.75,0
SUPER-SOT3 = smd 1 x 1.4: 1 -0.95,-1.1; 2 0.95,-1.1; 3 0,1.1
HC49/S = drill 0.813: 1 -2.413,0; 2 2.413,0
M1206 = smd 1.6 x 2: 1 -1.4,0; 2 1.4,0
STANDOFF-ELECTRICAL = drill 3.2 pad 6.35: P1 0,0
MA03-2 = drill 1.016: 1 -2.54,-1.27 | drill 1.016 octagon: 2 -2.54,1.27; 3 0,-1.27; 4 0,1.27; 5 2.54,-1.27; 6 2.54,1.27
MA03-1 = drill 1.016 long: 1 -2.54,0; 2 0,0; 3 2.54,0
MA04-2 = drill 1.016 octagon: 1 -3.81,-1.27; 2 -3.81,1.27; 3 -1.27,-1.27; 4 -1.27,1.27; 5 1.27,-1.27; 6 1.27,1.27; 7 3.81,-1.27; 8 3.81,1.27
MA20-2 = drill 1.016 octagon: 1 -24.13,-1.27; 2 -24.13,1.27; 3 -21.59,-1.27; 4 -21.59,1.27; 5 -19.05,-1.27; 6 -19.05,1.27; 7 -16.51,-1.27; 8 -16.51,1.27; 9 -13.97,-1.27; 10 -13.97,1.27; 11 -11.43,-1.27; 12 -11.43,1.27; 13 -8.89,-1.27; 14 -8.89,1.27; 15 -6.35,-1.27; 16 -6.35,1.27; 17 -3.81,-1.27; 18 -3.81,1.27; 19 -1.27,-1.27; 20 -1.27,1.27; 21 1.27,-1.27; 22 1.27,1.27; 23 3.81,-1.27; 24 3.81,1.27; 25 6.35,-1.27; 26 6.35,1.27; 27 8.89,-1.27; 28 8.89,1.27; 29 11.43,-1.27; 30 11.43,1.27; 31 13.97,-1.27; 32 13.97,1.27; 33 16.51,-1.27; 34 16.51,1.27; 35 19.05,-1.27; 36 19.05,1.27; 37 21.59,-1.27; 38 21.59,1.27; 39 24.13,-1.27; 40 24.13,1.27
QFP50P900X900X120-48N = smd 1.473 x 0.279: 1 -4.115,2.743; 2 -4.115,2.261; 3 -4.115,1.753; 4 -4.115,1.245; 5 -4.115,0.762; 6 -4.115,0.254; 7 -4.115,-0.254; 8 -4.115,-0.762; 9 -4.115,-1.245; 10 -4.115,-1.753; 11 -4.115,-2.261; 12 -4.115,-2.743; 25 4.115,-2.743; 26 4.115,-2.261; 27 4.115,-1.753; 28 4.115,-1.245; 29 4.115,-0.762; 30 4.115,-0.254; 31 4.115,0.254; 32 4.115,0.762; 33 4.115,1.245; 34 4.115,1.753; 35 4.115,2.261; 36 4.115,2.743 | smd 0.279 x 1.473: 13 -2.743,-4.115; 14 -2.261,-4.115; 15 -1.753,-4.115; 16 -1.245,-4.115; 17 -0.762,-4.115; 18 -0.254,-4.115; 19 0.254,-4.115; 20 0.762,-4.115; 21 1.245,-4.115; 22 1.753,-4.115; 23 2.261,-4.115; 24 2.743,-4.115; 37 2.743,4.115; 38 2.261,4.115; 39 1.753,4.115; 40 1.245,4.115; 41 0.762,4.115; 42 0.254,4.115; 43 -0.254,4.115; 44 -0.762,4.115; 45 -1.245,4.115; 46 -1.753,4.115; 47 -2.261,4.115; 48 -2.743,4.115
SOT95P270X145-5N = smd 1.321 x 0.559: 1 -1.372,0.94; 2 -1.372,0; 3 -1.372,-0.94; 4 1.372,-0.94; 5 1.372,0.94
SOIC10 = smd 0.579 x 1.3: P$1 -2,-2.659; P$2 -1,-2.659; P$3 0,-2.659; P$4 1,-2.659; P$5 2,-2.659; P$6 2,2.659; P$7 1,2.659; P$8 0,2.659; P$9 -1,2.659; P$10 -2,2.659
SOT95P255X145-3N = smd 0.559 x 1.321: 1 -0.94,-1.194; 2 0.94,-1.194; 3 0,1.194
SOT23-5 = smd 0.55 x 1.2: 1 -0.95,-1.3; 2 0,-1.3; 3 0.95,-1.3; 4 0.95,1.3; 5 -0.95,1.3
TSOT26 = smd 1 x 0.7: 1 -1.099,0.95; 2 -1.099,0; 3 -1.099,-0.95; 4 1.099,-0.95; 5 1.099,0; 6 1.099,0.95
SC-74A = smd 0.762 x 1.016: 1 2.032,0; 2 0,0; 3 0,2.159; 4 1.016,2.159; 5 2.032,2.159
SOT95P237X112-3N = smd 0.584 x 1.321: 1 -0.94,-1.016; 2 0.94,-1.016; 3 0,1.016
PTC_FUSE_BOURNS = smd 2.007 x 5.309: P$1 -3.302,0; P$2 3.302,0
TSR-1 = drill 0.7: GND 0,0; IN -2.54,0; OUT 2.54,0
SOT457_NXP_ESD = smd 1.499 x 0.551: 1_IO1 -1.6,0.95; 2_GND -1.6,0; 3_IO2 -1.6,-0.95; 4_IO3 1.6,-0.95; 5_V 1.6,0; 6_IO4 1.6,0.95

### Placement (x,y rotation side)
C1  17.78,26.54 270 bottom
C3  13.84,31.24 180 bottom
C4  41.34,44.7 90 bottom
C5  43.94,6.48 270 bottom
C10  30.99,4.7 180 top
C15  35.05,2.67 180 top
C19  8,4.76 180 top
C20  12.57,12.7 90 top
C21  17.91,8 0 top
C22  49.28,6.22 180 bottom
C_3V3_BULK  35.69,34.8 0 bottom
C_AVCC1  53.85,29.08 90 bottom
C_CURR_MEAS  46.23,10.67 180 bottom
C_CURR_MEAS1  48.13,33.4 0 bottom
C_CURR_MEAS2  51.82,37.34 180 bottom
C_CURR_MEAS3  48.39,36.45 0 top
C_LDO_IN1  29.91,22.48 0 bottom
C_LDO_OUT1  27.3,25.53 270 bottom
C_MCU_IN1  36.07,30.48 180 bottom
C_MCU_IN2  36.07,29.21 180 bottom
C_MCU_IN3  35.94,32.13 180 bottom
C_MCU_USB1  18.41,22.1 270 top
C_MOT_BYP1  46.48,44.83 90 bottom
C_MOT_BYP2  33.91,44.2 90 bottom
C_MOT_BYP3  36.2,45.34 90 bottom
C_PB_BYPASS  26.16,41.27 270 bottom
C_TEMP  51.05,29.84 270 top
C_TWI_3V3  4.95,33.53 90 top
C_TWI_3V3_2  4.83,23.24 90 top
C_TWI_5V_BYP  34.67,9.91 0 top
C_VCORE1  36.2,27.69 180 bottom
C_VCORE2  37.21,25.4 90 top
C_VCORE3  42.93,35.56 270 top
C_VDDANA_BULK  49.02,32.38 180 top
C_VDDIO1  33.4,37.21 270 bottom
C_VDDIO2  36.07,36.45 0 bottom
C_VMBAT  46.1,38.86 90 top
C_XTAL1  22.61,32.77 180 bottom
C_XTAL2  25.78,32.77 0 bottom
D2  44.96,38.73 180 bottom
D_PB_ZENER  24.38,41.27 270 bottom
J1  32.26,11.3 180 bottom
J2  3.05,31.62 90 bottom
J3  3.05,21.21 90 bottom
JP1  52.51,1.46 0 top
JP2  57.15,9.4 90 bottom
JP3  24.38,10.29 90 top
JP4  53.09,7.62 0 top
JP5  8.45,37.99 0 top
JP6  21.84,46.35 0 top
JP7  55.88,40.89 90 top
JP8  57.85,37.99 0 top
JP9  2.79,2.16 0 top
JP10  39.24,13.08 180 bottom
JP11  12.45,38.35 0 top
JP12  8.64,23.37 90 top
JP13  56.64,2.29 0 top
JP14  14.25,34.92 0 top
JP15  55.5,34.92 0 top
JP16  57.66,31.37 0 top
L_AVCC  51.01,27.28 180 top
L_AVCC1  39.75,32.77 90 bottom
L_TSR1  35.05,4.7 180 top
LED1  18.29,39.75 90 bottom
LED2  45.72,28.19 270 bottom
LED3  46.23,30.35 0 bottom
LED4  23.5,44.07 0 bottom
LED12  5.21,16.26 270 top
Q1  32.64,42.42 270 top
Q2  24.13,34.16 180 top
Q3  53.72,22.99 270 top
R1  16.76,39.37 270 bottom
R2  5.59,19.18 270 top
R3  31.75,9.53 180 top
R4  28.45,9.53 180 top
R5  48.64,12.83 90 top
R6  47.58,4.6 0 bottom
R7  49.33,7.94 180 bottom
R9  51.94,39.62 0 bottom
R10  48.39,39.5 90 bottom
R14  54.61,21.72 270 bottom
R15  53.98,24.26 180 bottom
R27  27.05,43.94 0 bottom
R43  7.11,32.38 270 top
R44  6.99,28.45 180 top
R_AMPSET_H  48.26,34.8 0 top
R_AMPSET_L  51.82,35.69 0 bottom
R_AUX_UART_RX  7.62,41.27 0 top
R_AUX_UART_TX  21.34,29.34 0 top
R_CPU_CURR1  39.12,6.99 0 top
R_CPU_CURR2  39.12,4.95 0 top
R_CPU_CURR3  39.12,2.92 0 top
R_CPU_RX  35.12,21.53 90 top
R_CPU_TX  37.21,21.59 270 top
R_CURR_MEAS  42.29,10.54 0 bottom
R_CURR_MEAS1  46.61,12.83 270 top
R_DRAIN_3V3  46.99,22.1 0 bottom
R_LED1  42.93,29.08 0 bottom
R_LED2  42.93,31.11 0 bottom
R_MCU_USB1  16.38,22.1 270 top
R_PB_PD  22.35,41.4 270 bottom
R_PB_PU  27.81,41.4 90 bottom
R_PU_RESET  39.75,11.05 180 top
R_PULSE_FAN  54.1,26.29 0 top
R_PULSE_FAN1  53.98,26.29 180 bottom
R_TEMP_H  53.72,31.75 180 top
R_TEMP_L  49.02,29.84 270 top
R_VCORE  35.18,25.78 90 top
R_VMBAT_H  50.29,39.37 0 top
R_VMBAT_L  47.75,38.86 90 top
R_VMBAT_S  43.69,39.24 180 top
S2  55.16,45.97 0 top
S3  10.16,45.97 0 top
SER_PWN_N_PD1  6.99,2.54 270 top
SER_PWN_N_PD2  20.45,8.89 90 top
SER_PWN_N_PD3  17.91,9.65 0 top
SER_PWN_N_PD4  9.02,2.54 270 top
SER_PWR_P_PU1  15.24,11.68 180 top
SER_PWR_P_PU2  10.16,6.1 180 bottom
SER_PWR_P_R1  15.24,13.72 0 top
SER_PWR_P_R2  10.16,4.06 180 bottom
SV1  13.08,25.27 270 bottom
SV2  3.43,44.7 270 bottom
SV3  49.78,45.21 270 top
SV4  30.99,47.5 180 top
SV5  3.17,9.27 90 top
SV6  57.4,24.64 270 bottom
SV7  42.67,24 90 top
SV8  33.15,17.34 180 bottom
SV9  17.14,44.83 270 top
U1  36.58,33.02 0 top
U2  47.75,35.94 180 bottom
U$1  45.21,44.83 0 top
U$2  30.35,25.27 90 bottom
U$3  37.59,44.83 0 top
U$4  39.24,8.13 180 bottom
U$5  7.49,7.87 180 top
U$6  7.49,12.57 180 top
U$7  20.45,37.21 90 bottom
U$8  52.96,22.73 270 bottom
U$9  17.78,11.68 0 top
U$13  53.85,29.08 90 top
U$14  48.39,4.7 90 top
U$15  25.27,42.04 180 top
U$16  29.72,3.05 0 bottom
U$17  17.78,26.54 90 top

### Tracks (layer width: path | path; a pad name or v marks a point on that pad's centre or on a via)
12V_N_CTRL  (via drill 0.6)
  Top 0.254: U1.10 31.27,31.27 28.96,28.96 27.81,28.96 26.8,27.94 26.8,27.18 v25.02,25.4 | v23.75,22.99 22.99,22.23 22.99,13.72 22.73,13.46 22.73,9.78 21.46,8.51 21.46,6.48 20.7,5.71 v17.78,5.71 | v13.34,3.68 12.32,3.68 10.41,1.78 9.11,1.78 SER_PWN_N_PD4.2
  Top 0.406: SER_PWN_N_PD1.2 SER_PWN_N_PD4.2
  Bottom 0.254: v17.78,5.71 15.24,5.71 v13.34,3.68 | v25.02,25.4 v23.75,22.99
12V_N_OUT
  Top 0.305: U$5.6 5.65,6.92 5.46,6.73 3.17,6.73 SV5.2
12V_P_CTRL  (via drill 0.6)
  Top 0.254: U$9.1 20.45,11.68 v20.7,11.43
  Bottom 0.254: v20.7,11.43 20.45,11.43 18.92,6.73 16.64,6.6 14.22,6.6 11.68,4.06 SER_PWR_P_R2.2
12V_P_OUT
  Top 0.305: SV5.4 3.17,9.27 5.59,9.27 6.04,8.82 U$5.4
+3V3  (via drill 0.6)
  Top 0.254: U1.17 35.81,29.97 v35.31,30.48 35.31,30.99 34.29,32.38 34.29,35.43 34.8,34.8 | v37.2,35.56 36.83,36.07 U1.42 36.83,35.31 36.2,34.8 34.8,34.8 | v32.64,37.97 33.22,37.13 U1.48 33.83,36.02 34.8,34.8 | R43.1 8.34,33.19 8.38,32.64 | R44.1 v9.02,28.45 | v48.39,27.3 48.8,27.3 L_AVCC.2 50.29,27.21 v50.29,26.29 | R_PU_RESET.2 39.24,11.39 JP10.1 | v35.69,14.22 35.69,16.76 35.12,17.34 33.85,17.34 33.15,18.03 33.15,20.45 33.02,20.57 33.02,21.97 v33.27,22.23
  Top 0.305: C_TWI_3V3.1 5.99,32.53 R43.1 | J3.3 3.08,22.24 C_TWI_3V3_2.1 6.62,22.24 v6.73,22.35 | v33.27,22.23 32.89,22.61 32.89,22.86 32.51,23.24 32.51,24.89 29.97,27.3 v29.46,27.3 | 3.43,44.7 SV2.4 | SV2.3 3.43,44.7 | 3.43,44.7 3.43,43.43 1.27,43.43 0.76,42.93 0.76,41.4 1.4,40.77 1.4,33.02 1.79,32.62 J2.3
  Top 0.406: v17.78,32.64 8.38,32.64 v8.38,33.15 | J2.3 4.86,32.62 C_TWI_3V3.1
  Bottom 0.254: C_MCU_IN3.1 35.32,32.23 C_MCU_IN1.1 | C_MCU_IN1.1 v35.31,30.48 | C_MCU_IN1.1 C_MCU_IN2.1 34.94,28.96 32.89,28.96 | v37.2,35.56 37.2,35.69 36.83,35.69 36.83,36.07 v37.2,35.56 | v32.64,37.97 33.39,37.97 C_VDDIO1.1 | v9.02,28.45 7.11,28.45 6.73,28.83 | C_3V3_BULK.1 37.09,36.07 C_VDDIO2.1 36.94,35.81 v37.2,35.56 | v48.39,27.3 47.24,26.16 45.72,26.16 | 45.72,26.16 45.47,26.16 44.58,25.27 | 44.58,25.27 38.73,25.27 37.72,24.26 34.67,24.26 33.15,22.73 v33.27,22.23 | JP10.1 36.96,13.08 v35.69,14.22 | 27.27,26.29 C_LDO_OUT1.1 | v50.29,26.29 52.41,26.27 R_PULSE_FAN1.1 | LED2.A 45.72,26.16 | R_DRAIN_3V3.2 45.72,22.1 44.96,22.99 44.83,23.11 44.83,25.02 44.58,25.27 | 31.68,27.61 32.51,28.32
  Bottom 0.305: U$2.2 30.28,26.21 31.11,27.05 31.68,27.61 | U$2.2 27.81,26.21 C_LDO_OUT1.1 | 35.22,30.44 v35.31,30.48 | 32.51,28.32 32.89,28.96 | v29.46,27.3 29.16,27 U$2.2
  Bottom 0.406: v17.78,32.64 18.29,32.64 19.81,31.11 25.53,31.11 26.04,30.61 31.75,30.61 32.89,29.72 32.89,28.96
  Bottom 0.813: v6.73,22.35 6.73,28.83 6.73,33.15 v8.38,33.15
+5V/3  (via drill 0.6)
  Top 0.254: R4.1 29.34,9.23 29.34,8.51 31.88,8.51 32.47,9.11 R3.1 33.14,10.19 33.26,10.19 | J1.3 33.26,10.19 | 33.26,10.19 C_TWI_5V_BYP.1
  Top 0.305: U$6.2 7.49,12.57 7.49,10.67 6.48,10.67 6.22,10.54 SV5.5 | C20.1 11.54,11.81 10.79,12.57 | SER_PWR_P_PU1.2 13.59,11.85 12.95,11.94 | 30.61,14.35 30.61,22.07 31.09,22.35 31.24,22.5 v31.24,23.88
  Top 0.406: 21.34,3.05 26.29,3.05 26.29,8 | 26.29,8 27.81,8 29.34,8.51 | 30.61,14.35 29.21,12.95 27.81,12.95 26.29,11.43 26.29,8
  Top 0.61: U$6.2 10.79,12.57 11.43,11.94 12.95,11.94 | U$16.OUT 26.29,3.05 17.14,3.05 16.76,3.43 16.76,4.06 13.46,7.37 13.46,10.17 C20.1
  Bottom 0.305: U$2.3 31.55,24.43 31.24,24.13 v31.24,23.88 31.24,22.5 C_LDO_IN1.1
+5V/4  (via drill 0.6)
  Top 0.254: U$17.5_V 17.78,29.21 | 17.78,29.21 17.53,29.59 16.13,29.59 15.75,29.21 12.06,29.21 11.81,28.96 SV1.2 | 2.79,14.73 5.22,14.72 LED12.A | v17.78,29.46 17.78,29.21
  Top 0.305: U$6.4 6.42,14.16
  Top 0.406: 6.42,14.16 5.22,14.72 4.95,14.73 2.79,14.73 1.91,13.84 SV5.8 | U$6.4 6.39,15.79 9.02,18.41 SV8.1 10.41,20 10.41,27.81 SV1.2
  Bottom 0.254: C3.1 11.81,30.84 SV1.2 | C1.1 v17.78,29.46
+12V  (via drill 0.6)
  Top 0.254: 50.89,19.72 51.78,20.57 52.68,20.59 55.61,20.59 v56.01,20.19 | v37.21,6.99 R_CPU_CURR1.1
  Top 0.305: U$5.2 7.49,7.87 7.49,6.1 7.3,5.91 5.91,5.91 5.46,5.46 SV5.1 | R_CPU_CURR3.1 38.61,2.58 | v10.92,7.11 10.92,7.75 11.05,7.87 | Q3.2 52.68,20.59 | 50.89,19.72 50.93,19.3 50.93,11.43 49.28,9.78 41.02,9.78 39.88,8.64 38.48,8.64 38.48,7.2 R_CPU_CURR1.1
  Top 0.406: L_TSR1.1 35.9,4.67 C15.1 38.14,2.67 R_CPU_CURR3.1
  Top 0.61: U$5.2 11.05,7.87 11.18,7.87 15.24,3.68 15.24,2.67 16.89,1.02 38.23,1.02 38.23,2.5 R_CPU_CURR3.1
  Top 0.813: R_CPU_CURR1.1 R_CPU_CURR2.1 38.39,7.11
  Top 1.016: R_CPU_CURR3.1 R_CPU_CURR2.1
  Bottom 0.254: R14.2 55.41,20.83 v56.01,20.19 | U$4.5 38.14,6.99 v37.21,6.99 | SER_PWR_P_PU2.2 10.92,6.1 v10.92,7.11
AUX_IO1
  Top 0.254: U1.26 41.63,30.76 42.16,30.23 42.16,28.7 40.51,27.05 40.51,24.38 40.89,24 SV7.2
AUX_IO2
  Top 0.254: U1.27 41.88,31.27 42.93,30.23 42.93,28.07 42.67,27.81 SV7.3
AUX_UART_RX  (via drill 0.6)
  Top 0.254: U1.44 35.81,38.86 v35.94,39.12 | v33.53,40.01 31.88,40.01 30.35,38.48 18.67,38.48 17.02,40.13 15.88,40.13 14.73,41.27 R_AUX_UART_RX.2
  Bottom 0.254: v35.94,39.12 35.18,39.12 34.29,40.01 v33.53,40.01
AUX_UART_TX  (via drill 0.6)
  Top 0.254: U1.11 31.52,30.76 29.21,28.45 28.57,28.45 v28.19,28.07 | v23.5,29.21 22.57,29.3 R_AUX_UART_TX.2
  Bottom 0.254: v28.19,28.07 27.81,28.45 24.89,28.45 24.13,29.21 v23.5,29.21
AVCC  (via drill 0.6)
  Top 0.254: L_AVCC.1 51.82,27.43 53.09,27.43 53.67,28.12 54.1,28.12 U$13.1
  Top 0.305: v54.9,28.87 U$13.1
  Bottom 0.305: C_AVCC1.1 v54.9,28.87
BATT_VOLT_SIG
  Top 0.254: R5.2 48.39,13.55 48.39,19.56 47.37,20.57 47.37,28.07 46.99,28.45 46.99,29.21 42.93,33.27 U1.31
BATT_VOLT_SIG_N  (via drill 0.6)
  Top 0.254: v48.64,10.79 R5.1
  Bottom 0.254: R6.1 48.44,5.4 C22.1 48.38,8.14 | 48.38,8.14 R7.1 | 48.38,8.14 48.64,8.41 v48.64,10.79
BATTERY
  Top 0.813: JP6.1 21.97,43.56
  Top 1.27: U$15.P$2 21.97,43.56
  Bottom 0.305: LED4.A 21.97,45.47 JP6.1
BATTERY_VOLTAGE  (via drill 0.6)
  Top 0.254: v41.15,6.86 41.02,7.11 40.77,7.11
  Top 0.813: R_CPU_CURR1.2 40.09,7.11 | 40.09,7.11 R_CPU_CURR2.2 | U$14.P$2 45.47,7.75 C5.+ 41.27,7.75 40.77,7.11 40.09,7.11
  Top 1.016: R_CPU_CURR3.2 R_CPU_CURR2.2
  Bottom 0.254: R6.2 46.71,4.6 45.97,4.57 45.97,7.49 45.72,7.75 C5.+ | U$4.4 40.22,6.86 v41.15,6.86
CPU_PWR_CTRL
  Top 0.254: U$9.2 SER_PWR_P_PU1.1 16.09,10.76 15.88,10.54 14.99,10.54 14.61,10.16 14.61,7.37 17.27,4.7 18.41,4.7 18.8,5.08 20.95,5.08 22.1,6.22 22.1,8 JP3.1
  Top 0.305: SER_PWR_P_R1.2 SER_PWR_P_PU1.1
CPU_PWR_CTRL_PIN  (via drill 0.6)
  Top 0.254: U1.7 30.48,32.77 28.19,30.48 27.05,30.48 25.02,28.45 24.38,28.45 23.62,27.69 v22.73,27.69 | v21.08,25.27 20.45,24.64 20.45,22.35 19.81,21.72 19.81,20.57 19.3,20.07 18.41,20.07 17.91,19.56 17.91,14.73 17.78,14.61 U$9.3
  Bottom 0.254: v21.08,25.27 v22.73,27.69
EXT_12V_P_CTRL_PIN  (via drill 0.6)
  Top 0.254: U1.8 30.73,32.26 28.45,29.97 27.3,29.97 25.15,27.81 24.64,27.81 23.62,26.8 v23.62,26.67 | U$9.5 20.45,14.48 20.45,21.34 21.08,21.97 21.08,23.5 v21.46,24
  Bottom 0.254: v23.62,26.67 v21.46,24
GND  (via drill 0.6)
  Top 0.254: v37.21,30.48 36.83,29.97 U1.19 36.83,27.29 36.95,27.04 | v37.47,32.51 38.35,33.4 | 38.35,33.4 38.73,33.4 39.6,34.27 U1.33 42.46,34.27 C_VCORE3.2 43.18,34.54 45.35,32.38 v46.35,32.38 | 36.95,27.04 36.96,26.91 C_VCORE2.2 | v36.83,27.05 36.95,27.04 | U1.45 35.33,35.94 35.56,35.94 | 35.56,35.94 36.32,35.94 U1.43 | v35.43,35.69 35.56,35.94 | U1.1 32.41,36.07 v32.13,36.32 30.86,36.32 30.48,35.94 22.48,35.94 22.23,35.69 20.95,35.69 20.07,34.8 20.07,33.91 21.21,32.77 22.61,32.77 24,34.16 v24.13,34.16 | R_VMBAT_L.1 47.98,37.96 C_VMBAT.1 53.45,37.99 v54.1,37.34 | v44.96,35.94 44.96,35.05 44.83,34.8 44.83,33.78 45.34,33.27 45.85,33.27 46.48,33.66 50.8,33.66 v51.56,33.4 | 38.35,33.4 35.18,33.4 v35.18,33.78 | C_TWI_5V_BYP.2 35.26,9.94 J1.4 | U$9.4 18.8,12.7 v21.21,12.7 | v20.45,6.86 SER_PWN_N_PD2.1 | R_MCU_USB1.2 C_MCU_USB1.2 14.64,21.25 v14.35,20.95 | R2.1 6.77,20.07 v6.86,20.45
  Top 0.305: U$5.5 4.7,7.87 SV5.3 | C21.2 19.25,8.04 SER_PWN_N_PD2.1 | SER_PWN_N_PD1.1 7.13,3.53 C19.2 7.13,4.83 v6.35,4.83 | U$13.3 50.76,29 C_TEMP.2 R_TEMP_L.2 48.22,29 v48.01,29.08 | J2.4 4.86,34.62 C_TWI_3V3.2 | C_TWI_3V3_2.2 3.08,24.24 J3.4 | 52.81,29.11 v52.77,30
  Top 0.406: 52.81,29.11 52.64,29.08 U$13.3 | U$6.5 5.84,12.7 4.83,12.7 SV5.7 | 30.14,3.56 C10.2 | C15.2 33.44,1.91 30.99,1.91 29.84,3.05 30.14,3.56 | 30.14,3.56 U$16.GND | C_VDDANA_BULK.2 v46.35,32.38
  Bottom 0.254: C22.2 50.18,6.39 R7.2 | 53.09,6.22 53.09,4.7 50.93,3.17 50.93,2.54 49.78,1.4 43.94,1.4 C5.- | 36.96,30.23 v37.21,30.48 C_MCU_IN1.2 | C_MCU_IN1.2 37.05,30.63 C_MCU_IN3.2 37.08,32.3 v37.47,32.51 | C_VCORE1.2 36.96,27.19 v36.83,27.05 35.94,26.16 34.67,26.16 | C_MCU_IN2.2 C_MCU_IN1.2 | 27.39,24.33 27.52,24.42 27.61,24.26 27.56,24.38 | v35.43,35.69 35.57,35.94 C_VDDIO2.2 34.29,36.45 34.29,36.34 | v32.13,36.32 33.01,36.08 C_VDDIO1.2 34.29,36.34 | C_CURR_MEAS2.2 52.67,37.31 R_AMPSET_L.1 52.67,34.76 51.94,33.78 v51.56,33.4 | C_CURR_MEAS2.2 52.69,37.45 53.34,38.73 R9.1 53.34,40.19 53.8,40.64 | 47.62,33.4 46.86,33.4 v46.35,32.38 | C_XTAL2.2 C_XTAL1.2 23.48,34.15 23.5,34.16 v24.13,34.16 24.13,34.8 23.24,35.69 21.46,35.69 21.46,38.23 U$7.4 | v54.1,37.34 C_CURR_MEAS2.2 | U2.2 v44.96,35.94 | C22.2 53.09,6.22 | 53.09,6.22 JP4.1 | 34.29,36.34 C_3V3_BULK.2 34.29,33.78 v35.18,33.78 | JP10.3 45.59,11.81 49.53,11.81 50.04,11.3 C22.2 | 21.59,12.32 v21.21,12.7 21.21,13.21 20.45,13.97 20.45,17.4 | 21.59,12.32 21.72,12.19 21.72,6.99 | 21.72,6.99 29.72,6.99 U$16.GND | 21.72,6.99 21.59,6.99 v20.45,6.86 | SV8.9 19.18,17.4 20.45,17.4 | 20.45,17.4 20.45,21.97 | 20.45,21.97 25.91,21.97 | JP3.2 22.1,12.83 21.59,12.32 | C3.2 15.11,31.14 15.24,31.01 15.24,29.21 13.59,29.21 13.08,28.7 13.08,26.54 11.81,26.54 | 13.08,24 13.08,21.59 13.72,20.95 v14.35,20.95 14.64,21.25 15.24,21.25 15.96,21.97 20.45,21.97 | 13.08,24 13.08,25.27 SV1.4 11.81,26.54 | C1.2 15.85,25.04 15.75,24.64 15.11,24 13.08,24 | 10.92,26.54 11.81,26.54 | U$8.4 51.82,21.72 | 51.82,21.72 51.82,23.62 51.18,23.62 49.28,26.04 49.28,29.97 | SV6.3 55.75,21.72 51.82,21.72
  Bottom 0.254: v6.86,20.45 6.35,20.19 4.95,20.19 | SV7.1 41.91,22.35 38.23,22.35 37.08,21.21 32.13,21.21 | LED3.C 48.01,30.35 48.39,29.97
  Bottom 0.305: 43.94,1.91 C5.- | U$7.4 19.43,38.23 | U$16.GND 29.72,2.92 28.7,1.91 6.35,1.91 v6.35,4.83 6.35,6.1 SV5.3 3.17,9.27 3.17,12.06 4.19,13.08 SV5.7 4.45,14.35 4.95,14.73 | C_CURR_MEAS1.2 47.62,33.4 47.62,35.94 U2.2 | 4.95,34.67 4.91,34.62 J2.4 3.05,40.01 3.43,40.39 3.43,45.97 4.7,45.97 SV2.1 SV2.2 | J3.4 4.87,24.21 4.95,24.13 | 29.08,22.48 C_LDO_IN1.2 | C_LDO_IN1.2 26.42,22.48 25.91,21.97 | 27.56,24.38 29.21,24.38 29.21,23.75 29.06,23.52 C_LDO_IN1.2 | 34.67,26.16 32.51,24 32.51,23.24 32.13,22.86 32.13,21.21 29.08,21.21 29.06,21.23 C_LDO_IN1.2 | v48.01,29.08 48.39,29.97 49.28,29.97 50.42,29.97 52.2,31.5 52.2,32.64 v51.56,33.4 | v52.77,30 C_AVCC1.2
  Bottom 0.406: U$2.1 27.39,24.33 C_LDO_OUT1.2 | 29.08,22.48 29.59,22.61 C_LDO_IN1.2 29.34,22.57 | 43.94,1.91 30.86,1.91 U$16.GND | JP7.1 53.8,40.64 | JP12.1 JP12.2 10.46,26.09 10.92,26.54
  Bottom 0.813: 4.95,34.67 4.95,24.13 4.95,20.19 4.95,14.73
  other vias: 52.96,10.67 52.96,12.57 37.21,11.3 30.61,7.11 13.59,1.4 11.81,1.4 25.53,19.94 8.51,20.95 10.79,35.43 5.33,39.37 17.4,36.32 19.43,34.29 24.89,36.96 27.94,36.96 12.06,20.83
  pour Bottom (isolate 0.305): 56.9,0.25 6.35,0.25 5.59,1.02 5.59,3.43 4.7,4.32 1.14,4.32 0.25,5.21 0.25,46.23 3.17,49.15 4.7,49.15 5.97,47.88 5.97,44.32 8.89,41.15 15.88,41.15 18.41,38.73 30.35,38.73 32.13,40.51 45.97,40.51 47.62,38.86 48.51,38.86 49.53,37.85 52.2,37.85 52.83,38.48 52.83,41.66 53.21,42.04 59.56,42.04 59.69,41.91 59.69,3.05
  pour Top (isolate 0.305): 0.38,4.95 0.38,46.48 2.79,48.9 4.95,48.9 5.97,47.88 5.97,44.2 8.89,41.27 14.1,41.27 17.02,38.35 29.97,38.35 32.13,40.51 51.82,40.51 53.34,42.04 59.44,42.04 59.56,41.91 59.69,9.4 45.09,9.4 45.09,0.25 6.1,0.38 5.59,0.89 5.59,3.3 4.7,4.19 1.14,4.19
M1_INA
  Top 0.254: U1.40 37.82,38.51 37.72,38.61 37.72,39.37 38.23,39.88 41.4,39.88 42.16,40.39 44.7,40.39 45.21,40.89 | 45.21,40.89 U$1.P$3 | U$1.P$5 47.21,41.12 47.24,40.89 45.21,40.89
M1_INB
  Top 0.254: U1.41 37.34,38.23 37.21,38.35 37.21,39.62 37.97,40.39 41.15,40.39 41.91,40.89 44.07,40.89 44.2,41.27 44.2,42.16 U$1.P$2 44.21,43.07 44.45,43.31 45.97,43.31 46.23,43.05 46.23,42.19 U$1.P$4
M2_INA
  Top 0.254: U1.46 34.82,38.89 34.92,38.99 34.92,39.37 35.69,40.13 36.07,40.13 36.83,40.89 37.59,40.89 | 37.59,40.89 39.12,40.89 39.5,41.27 39.5,42.08 U$3.P$5 | U$3.P$3 37.59,40.89
M2_INB
  Top 0.254: U1.47 34.31,39.14 34.42,39.24 34.42,39.62 35.43,40.64 35.81,40.64 36.58,41.4 36.58,42.16 U$3.P$2 36.59,43.2 36.7,43.31 38.35,43.31 38.48,43.18 38.48,42.28 U$3.P$4
MOT_GND  (via drill 0.6)
  Top 0.254: v39.75,47.24 40.64,47.24 40.77,47.12 40.77,47.05 C4.-
  Top 0.406: v47.37,46.74 47.21,47.15 U$1.P$6 47.21,47.85 v47.37,47.75 | v39.75,48.26 39.59,48.1 U$3.P$6 39.75,47.46 v39.75,47.24
  Bottom 0.254: R9.2 50.16,39.62 49.53,40.26 48.48,40.26 R10.2 | R1.1 14.64,40.68 14.61,42.42 14.61,46.1 15.88,46.1 SV9.1 | SV4.3 28.45,47.62 27.69,48.39
  Bottom 0.305: 35.18,46.1 36.05,46.1 C_MOT_BYP3.2 | SV3.3 47.75,42.67 47.75,43.69 47.62,44.2 47.62,46.48 47.37,46.23 | 27.69,48.39 19.68,48.39 18.67,47.37 SV9.2 | C_MOT_BYP2.2 33.66,44.96 33.91,45.21
  Bottom 0.406: v47.37,46.74 47.37,46.23 46.99,45.85 46.75,45.85 C_MOT_BYP1.2 41.99,45.83 C4.- | 41.4,46.48 C4.- | SV4.3 28.45,46.86 30.1,45.21 33.91,45.21 34.42,45.21 35.18,46.1 | C_MOT_BYP3.2 39.48,46.21 39.75,46.48 C4.- | SV9.1 SV9.2
  Bottom 0.61: SV3.3 49.78,41.78 50.29,41.27 R9.2
  pour Bottom (isolate 0.305, rank 2): 14.73,42.04 16.89,42.04 19.18,39.75 29.97,39.75 31.75,41.53 51.31,41.53 51.56,41.78 51.56,43.56 51.44,44.07 51.44,48.64 50.93,49.15 15.37,49.15 14.61,48.39 14.61,42.16
MOT_PWR_CTRL_PIN  (via drill 0.6)
  Top 0.254: U1.36 40.69,36.25 v41.15,36.7
  Bottom 0.254: v41.15,36.7 41.15,38.23 39.12,40.26 34.92,40.26 34.29,40.89 32.51,40.89 30.35,38.73 23.88,38.73 23.37,39.24 U$7.5
MOTOR_PWR  (via drill 0.6)
  Top 0.254: C4.+ 41.34,44.13 41.4,44.45 | R_VMBAT_H.2 51.02,39.5 51.05,39.75 51.05,40.64 51.94,41.78 51.94,42.8 51.44,43.94 46.8,43.94 46.66,44.09 45.45,44.09 v45.34,44.2
  Top 0.305: SV9.4 19.94,46.35 19.94,48.01 20.57,48.64 24,48.64 27.3,45.34 30.23,45.34 30.73,44.83 31.88,44.83 32.26,44.45 34.16,44.45 34.92,44.2
  Top 0.406: Q1.3 33.78,44.32 34.92,44.2 | U$3.P$1 35.59,44.35 35.69,44.45 | U$1.P$1 43.21,44.04 43.31,43.94 v44.32,44.2 v45.34,44.2
  Top 1.016: 34.92,44.2 v35.43,44.45 35.69,44.45 v37.21,44.45 41.4,44.45 42.8,44.45 43.31,43.94
  Bottom 0.254: LED1.A 18.29,40.51 17.14,41.66 17.14,43.56 15.88,43.56 SV9.3
  Bottom 0.305: C_MOT_BYP2.1 34.05,43.07 v35.43,44.45
  Bottom 0.406: SV9.3 SV9.4 | C_MOT_BYP1.1 45.35,44.21 v44.32,44.2 | C_MOT_BYP3.1 35.57,44.59 v35.43,44.45 v37.21,44.45
  pour Top (isolate 0.305, rank 2): 14.48,48.39 14.48,42.55 16.13,40.89 17.27,40.89 19.05,39.12 19.81,39.12 20.07,39.37 20.07,47.24 20.95,48.13 22.86,48.13 23.62,47.37 23.62,45.85 24,45.47 30.1,45.47 30.61,44.96 30.61,44.83 30.99,44.45 30.99,41.91 31.5,41.4 51.18,41.4 51.56,41.78 51.56,48.64 51.18,49.02 15.11,49.02
N$1
  Top 0.254: R_AUX_UART_RX.1 6.73,41.27 5.84,42.16 SV2.5
N$2
  Bottom 0.254: R_LED2.1 44.72,31.11 LED3.A
N$3
  Bottom 0.254: R_LED1.1 45.58,29.08 LED2.C
N$4
  Bottom 0.254: R_CURR_MEAS.2 40.89,10.5 40.89,9.4 40.22,9.4 U$4.3
N$5
  Top 0.254: R_VMBAT_H.1 R_VMBAT_L.2 46.63,39.66 C_VMBAT.2 45.03,39.64 R_VMBAT_S.1
N$6
  Top 0.813: JP1.1 49.21,1.46 U$14.P$1
N$7
  Top 0.254: R_VCORE.1 36.83,24.93 C_VCORE2.1
N$10
  Top 0.305: U$6.3 10.77,13.52 12.23,13.84 12.94,13.84 | 12.94,13.84 SER_PWR_P_R1.1 | C20.2 12.94,13.84
N$11
  Top 0.406: SV3.1 49.15,47.75 48.13,48.77 45.21,48.77 | 45.21,48.77 43.56,48.77 43.21,48.42 U$1.P$10 | U$1.P$8 45.21,48.77
N$12
  Top 0.305: C19.1 8.94,4.83 9.02,4.83
  Top 0.406: SER_PWN_N_PD4.1 9.02,4.83 9.02,6.35 8.51,6.84 U$5.1
N$13
  Top 0.406: U$1.P$9 44.21,46.59 44.58,46.23 46.23,46.23 | 46.23,46.23 47.24,45.21 SV3.2 | U$1.P$7 46.21,46.24 46.23,46.23
N$14  (via drill 0.6)
  Top 0.305: U$15.P$1 28.57,42.29 | 28.57,42.29 v29.02,41.02 | 28.57,42.29 28.7,42.42 28.7,43.05 28.45,43.31 | 28.76,42.99 27.81,43.31 28.45,43.31 | Q1.2 30.29,41.47 30.04,41.47 | v29.08,43.94 28.45,43.31
  Top 0.406: 30.04,41.47 29.27,41.47 v29.02,41.02
  Bottom 0.254: R_PB_PU.1 27.73,40.81 28.45,41.02 v29.02,41.02
  Bottom 0.305: D_PB_ZENER.2 24.26,40.4 C_PB_BYPASS.2 27.69,40.42 R_PB_PU.1 | R27.1 v29.08,43.94
N$15  (via drill 0.6)
  Top 0.305: v9.78,9.02 9.08,8.82 U$5.3
  Bottom 0.254: 9.4,4.19 9.31,4.19 SER_PWR_P_PU2.1 9.29,6.1 9.29,7
  Bottom 0.305: SER_PWR_P_R2.1 9.4,4.19 | v9.78,9.02 9.27,7.62 9.29,7
N$16  (via drill 0.6)
  Top 0.254: R_AUX_UART_TX.1 19.81,29.34 18.8,30.35 10.54,30.35 v9.91,29.72 | v9.91,33.66 9.53,33.66 8.64,34.54 7.62,34.54 3.68,38.48 3.68,39.37 2.16,40.89 SV2.6
  Bottom 0.254: v9.91,29.72 v9.91,33.66
N$17  (via drill 0.6)
  Top 0.305: Q1.1 30.96,43.37 v30.61,43.37
  Bottom 0.305: 24.89,42.4 C_PB_BYPASS.1 | C_PB_BYPASS.1 26.42,42.25 R_PB_PU.2 29.25,42.25 v30.61,43.37 | C_PB_BYPASS.1 25.02,42.22 D_PB_ZENER.1 23.24,42.29 R_PB_PD.1
N$18
  Top 0.254: R_TEMP_H.1 54.57,30.06 U$13.2
N$19
  Bottom 0.305: U$7.1 R_PB_PD.2
N$20
  Bottom 0.254: R1.2 16.48,39 LED1.C
N$21
  Top 0.406: U$3.P$7 38.59,46.72 38.1,46.23 36.32,46.23 | 36.32,46.23 35.31,46.23 34.42,45.21 32.89,45.21 30.99,46.99 SV4.2 | U$3.P$9 36.59,46.24 36.32,46.23
N$22
  Top 0.406: U$3.P$8 37.59,48.64 37.47,48.77 35.69,48.77 | 35.69,48.77 34.16,48.77 SV4.1 | U$3.P$10 35.59,48.67 35.69,48.77
N$24  (via drill 0.6)
  Top 0.254: v38.86,30.99 37.97,31.5 36.7,31.5 36.32,31.11 U1.18 36.32,27.94 v35.43,27.3 35.18,27.05 R_VCORE.2
  Bottom 0.254: v38.86,30.99 39.37,31.28 L_AVCC1.1 | C_VCORE1.1 35.32,27.67 v35.43,27.3
N$25
  Top 0.406: U$16.IN 31.84,3.47 C10.1 L_TSR1.2
N$26
  Bottom 0.254: R10.1 46.5,38.65 D2.A | R10.1 48.73,38.65 49.66,37.72 49.92,37.72 C_CURR_MEAS2.1 | U2.3 47.13,36.88 R10.1
N$27  (via drill 0.6)
  Top 0.254: 49.26,35.2 R_AMPSET_H.2 | C_CURR_MEAS3.2 49.26,35.2 | 49.26,35.2 49.26,35.07 49.4,34.8 50.04,34.8 v51.05,34.67
  Bottom 0.254: U2.4 49.12,36.85 49.91,36.07 50.33,35.69 R_AMPSET_L.2 51.05,35.6 v51.05,34.67
N$28
  Bottom 0.406: LED4.C 26.04,44.07 26.04,43.94 R27.2
N$30
  Top 0.254: R_CPU_RX.1 35.12,20.13 35.69,19.56 35.69,17.91 36.26,17.34 36.96,17.34 SV8.24
N$31
  Top 0.254: R_CPU_TX.2 37.21,18.86 SV8.23
N$32
  Top 0.254: SV1.6 SV1.5 14.44,22.95 R_MCU_USB1.1 17.4,22.95 | U$17.2_GND 17.78,23.75 17.4,23.37 17.4,22.95 | 17.4,22.95 C_MCU_USB1.1
N$34  (via drill 0.6)
  Top 0.254: v51.69,24.64 52.39,23.94 Q3.1
  Bottom 0.254: R15.1 52.74,24.64 v51.69,24.64
N$35
  Bottom 0.254: U$8.2 53.59,22.73 53.76,22.57 R14.1 54.48,23.11 54.83,23.46 R15.2
N$37
  Top 0.254: Q3.3 55.58,23.88 SV6.2
N$38
  Top 0.254: R_PULSE_FAN.2 55.88,27.18 SV6.1
  Bottom 0.254: R_PULSE_FAN1.2 55.9,27.2 SV6.1
N$42  (via drill 0.6)
  Top 0.254: v15.62,9.53 16,9.53
  Top 0.305: 16,9.53 17.27,9.53 C21.1 17.3,9.36 SER_PWN_N_PD3.1 | v12.19,9.65 10.22,11.62 U$6.1
  Bottom 0.254: v12.19,9.65 14.86,9.65 v15.62,9.53
N$45
  Top 0.254: LED12.C 5.2,17.4 5.59,17.78 R2.2
PWR_FAN  (via drill 0.6)
  Top 0.254: v45.72,23.75 45.47,23.75 44.7,24.51 44.7,29.21 42.14,31.77 U1.28 | v49.78,22.73 v48.39,23.88
  Bottom 0.254: U$8.3 v49.78,22.73 | v48.39,23.88 v45.72,23.75
PWR_LED_CTRL  (via drill 0.6)
  Top 0.254: U1.9 31.01,31.77 28.7,29.46 27.56,29.46 v24.89,26.8 | v22.73,23.88 22.35,23.5 22.35,22.23 21.46,21.34 v21.46,20.57 | v21.97,14.1 22.1,13.84 22.1,10.83 21.13,9.87 SER_PWN_N_PD2.2 20.36,9.65 SER_PWN_N_PD3.2
  Bottom 0.254: v21.46,20.57 22.73,20.57 22.99,20.32 22.99,15.11 v21.97,14.1 | v24.89,26.8 v22.73,23.88
PWR_LED_OUT_N
  Top 0.305: SV5.6 3.17,11.81 5.71,11.81 5.9,11.62 U$6.6
RESET  (via drill 0.6)
  Top 0.254: U1.22 38.33,27.96 39.12,27.18 39.12,21.34 v39.5,20.95 | R_PU_RESET.1 41.78,12.1 JP10.2
  Bottom 0.254: v39.5,20.95 40.77,19.68 40.77,13.97 JP10.2
RX_EXT_PIN
  Top 0.254: U1.15 34.82,27.96 33.78,26.92 33.78,24.13 34.54,23.37 35.94,23.37 36.83,22.48 R_CPU_TX.1
SCL  (via drill 0.6)
  Top 0.254: 6.22,29.72 8.38,29.72 9.65,30.99 19.05,30.99 19.56,30.48 24.51,30.48 v25.02,29.97 | 6.22,29.72 5.46,29.72 4.32,28.57 3.1,28.57 J2.1 | U1.12 32.05,30.28 v31.62,29.21 | R44.2 6.13,29.63 6.22,29.72
  Bottom 0.254: v31.62,29.21 31.5,29.21 31.24,29.46 25.53,29.46 v25.02,29.97 | 3,18.21 J3.1 | 1.65,27.13 1.65,27.23 J2.1
  Bottom 0.305: 1.65,27.13 1.65,19.56 3,18.21
SCL_5V
  Top 0.254: U1.20 37.34,27.94 37.72,27.43 38.1,27.43 38.48,27.05 38.48,19.56 38.23,19.3 38.23,15.24 36.2,13.21 32.13,13.21 31.75,12.83 30.99,12.83 30.4,12.24 30.02,12.24 J1.1 29,11.05 28.19,11.05 27.6,10.45 R4.2
SDA  (via drill 0.6)
  Top 0.254: U1.39 38.33,38.84 v38.61,38.99 | v30.73,33.66 30.61,33.66 28.07,31.11 19.81,31.11 19.3,31.62 9.4,31.62 8.38,30.61 7.11,30.61 | 7.11,30.61 3.06,30.61 J2.2 | R43.2 7.11,30.61
  Top 0.305: 3.06,30.61 2.41,30.61 1.65,29.84 1.65,21.08 2.41,20.32 2.94,20.32 J3.2
  Bottom 0.254: v38.61,38.99 37.85,38.23 35.18,38.23 34.29,39.12 32.38,39.12 31.24,37.97 31.24,36.96 30.73,36.45 v30.73,33.66
SDA_5V
  Top 0.254: U1.24 39.32,28.37 39.37,27.94 39.75,27.56 39.75,22.35 40.51,21.59 40.51,19.56 40.77,19.3 40.77,15.37 40.13,14.73 38.61,14.73 36.45,12.57 32.64,12.57 32.26,12.19 31.26,12.19 J1.2 31.24,10.4 31.24,10.29 30.9,9.95 R3.2
SIG_CPU_BATT_CURR
  Top 0.254: R_CURR_MEAS1.1 46.61,14.35 45.85,15.11 45.85,19.3 46.74,20.19 46.74,27.81 46.35,28.19 46.35,29.08 42.67,32.77 U1.30
SIG_CPU_BATT_CURRENT_N  (via drill 0.6)
  Top 0.254: v44.32,10.79 45.47,10.79 R_CURR_MEAS1.2
  Bottom 0.254: C_CURR_MEAS.1 45.35,10.79 v44.32,10.79 42.89,10.79 R_CURR_MEAS.1
SIG_FAN  (via drill 0.6)
  Top 0.254: U1.29 42.42,32.26 45.72,28.96 v45.72,25.02 | v48.39,25.15 48.64,25.27 50.67,25.27 51.94,26.04 52.7,26.04 52.96,26.29 R_PULSE_FAN.1
  Bottom 0.254: v45.72,25.02 v48.39,25.15
SIG_MOT_CURR  (via drill 0.6)
  Top 0.254: 47.51,34.7 C_CURR_MEAS3.1 45.97,36.45 43.69,38.23 41.02,38.23 39.93,37.13 U1.37 | 47.51,34.7 R_AMPSET_H.1 | 47.51,34.7 46.89,34.7 v45.72,34.16
  Bottom 0.254: v45.72,34.16 45.8,34.42 U2.1
SIG_TEMP_SENS
  Top 0.254: R_TEMP_L.1 46.35,30.7 46.23,30.73 43.18,33.78 U1.32
  Top 0.305: R_TEMP_L.1 C_TEMP.1 50.93,30.7 R_TEMP_H.2
SIG_VMBAT
  Top 0.254: U1.38 38.84,38.08 38.99,38.23 39.12,38.23 39.75,38.86 42.46,38.86 R_VMBAT_S.2
STATUS_LED  (via drill 0.6)
  Top 0.254: v40.89,29.46 40.69,29.64 U1.25
  Bottom 0.254: v40.89,29.46 41.66,29.46 R_LED1.2 R_LED2.2
TX_EXT_PIN
  Top 0.254: U1.13 33.83,27.86 33.15,27.18 33.15,23.88 34.67,22.35 35.05,22.57 R_CPU_RX.2
USB_C_DN  (via drill 0.6)
  Top 0.254: v26.29,21.08 26.29,21.97 21.97,26.29 16.83,26.29 | 16.83,26.29 U$17.1_IO1 | SV1.3 15.37,26.29 16.83,26.29
  Bottom 0.254: SV8.20 31.69,16.07 30.61,17.14 30.61,19.3 29.84,20.07 27.3,20.07 v26.29,21.08
USB_C_DP  (via drill 0.6)
  Top 0.254: v27.69,20.95 27.69,21.34 22.23,26.8 16.83,26.8 | 16.83,26.8 U$17.6_IO4 | SV1.1 15.37,26.8 16.83,26.8
  Bottom 0.254: SV8.22 34.42,16.13 33.15,17.4 33.15,19.18 32.38,19.94 30.86,19.94 30.23,20.57 28.07,20.57 v27.69,20.95
VDDANA  (via drill 0.6)
  Top 0.254: v39.24,35.05 39.47,34.77 U1.34 U1.35 41.9,35.28 42.15,35.55 42.16,35.81 C_VCORE3.1 42.91,36.31 v42.93,37.21
  Top 0.305: v51.05,32.13 50.29,32.38 C_VDDANA_BULK.1
  Bottom 0.254: L_AVCC1.2 39.24,33.78 v39.24,35.05 | D2.C 42.93,38.55 v42.93,37.21 42.93,34.16 45.72,31.37 47.37,31.37 48.39,32.38 48.39,33.03 C_CURR_MEAS1.1
  Bottom 0.305: C_CURR_MEAS1.1 49.01,35 U2.5 | 48.39,32.38 50.29,32.38 v51.05,32.13
XTAL1
  Top 0.254: Q2.1 27.15,34.77 U1.3
  Bottom 0.254: C_XTAL2.1 26.54,32.88 Q2.1
XTAL2
  Top 0.254: Q2.2 22.84,35.28 U1.2
  Bottom 0.254: C_XTAL1.1 21.72,32.78 Q2.2

### Text on the board
_tsilk: RobotBoardMini v3.02 / (c) Johannes / Sulkakoski, 2016 / johannes.sulkakoski / @systemlive.fi
_bsilk: Battery / CPU